# EAGLE design scooter (EAGLE 4.16)
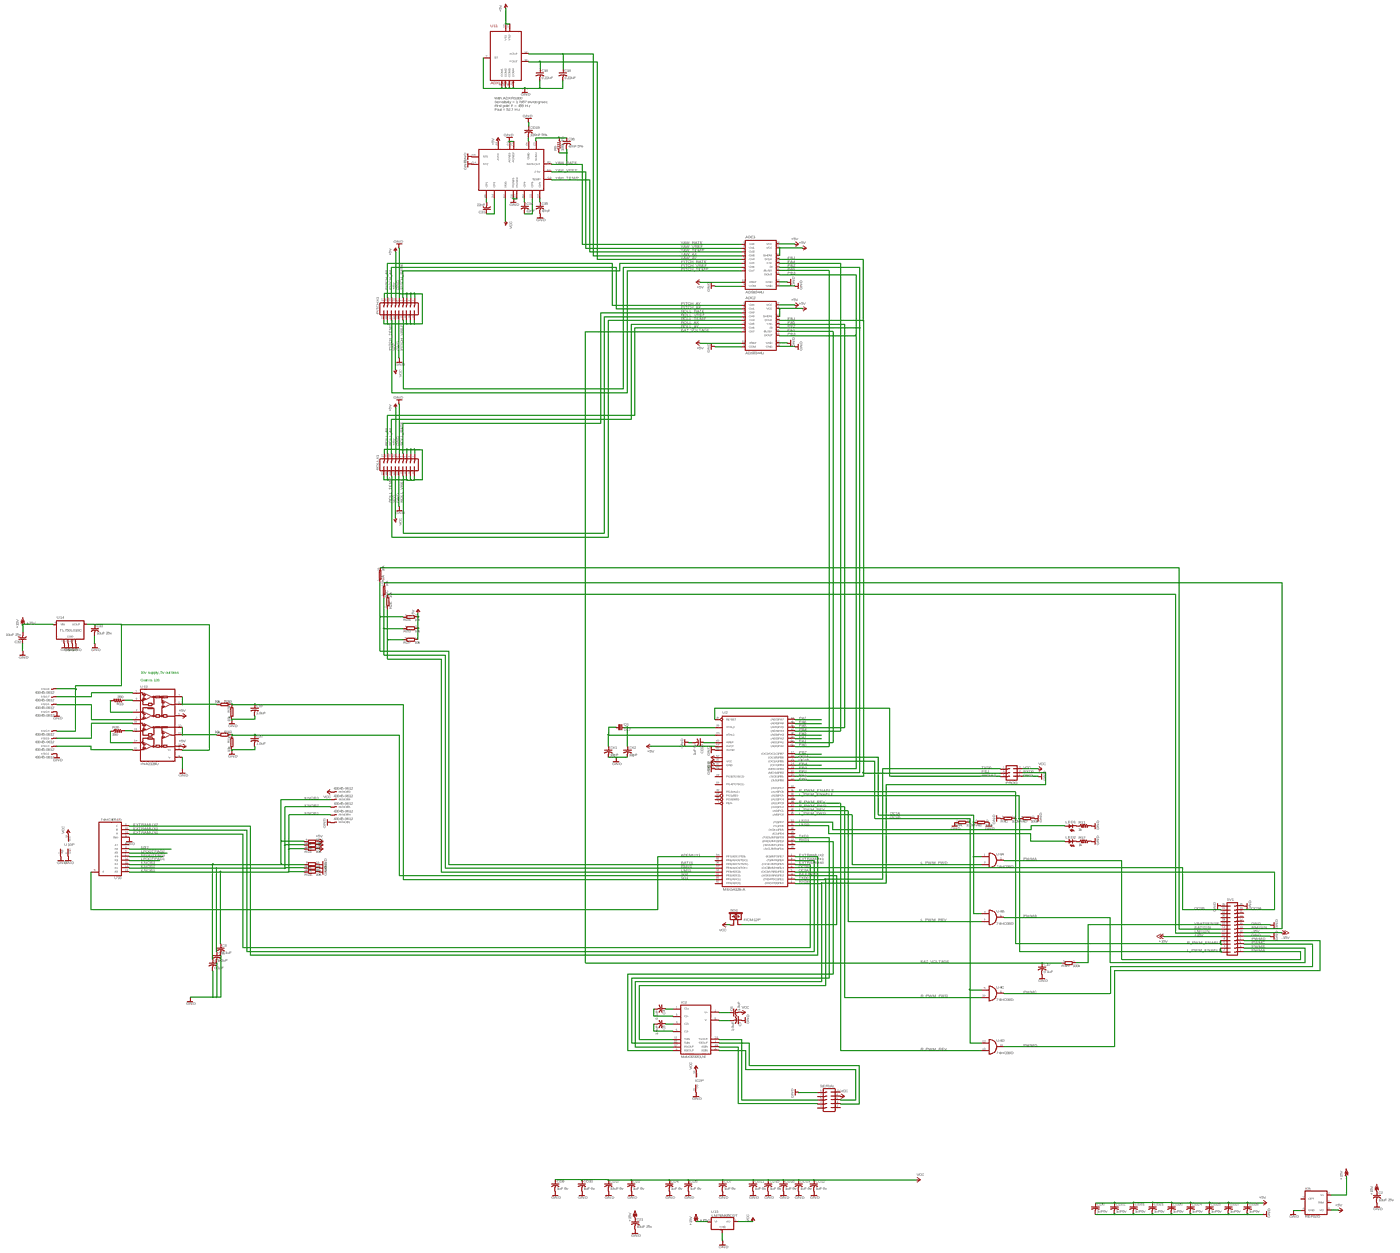
[diagram p0: schematic, sheet 1, overview]
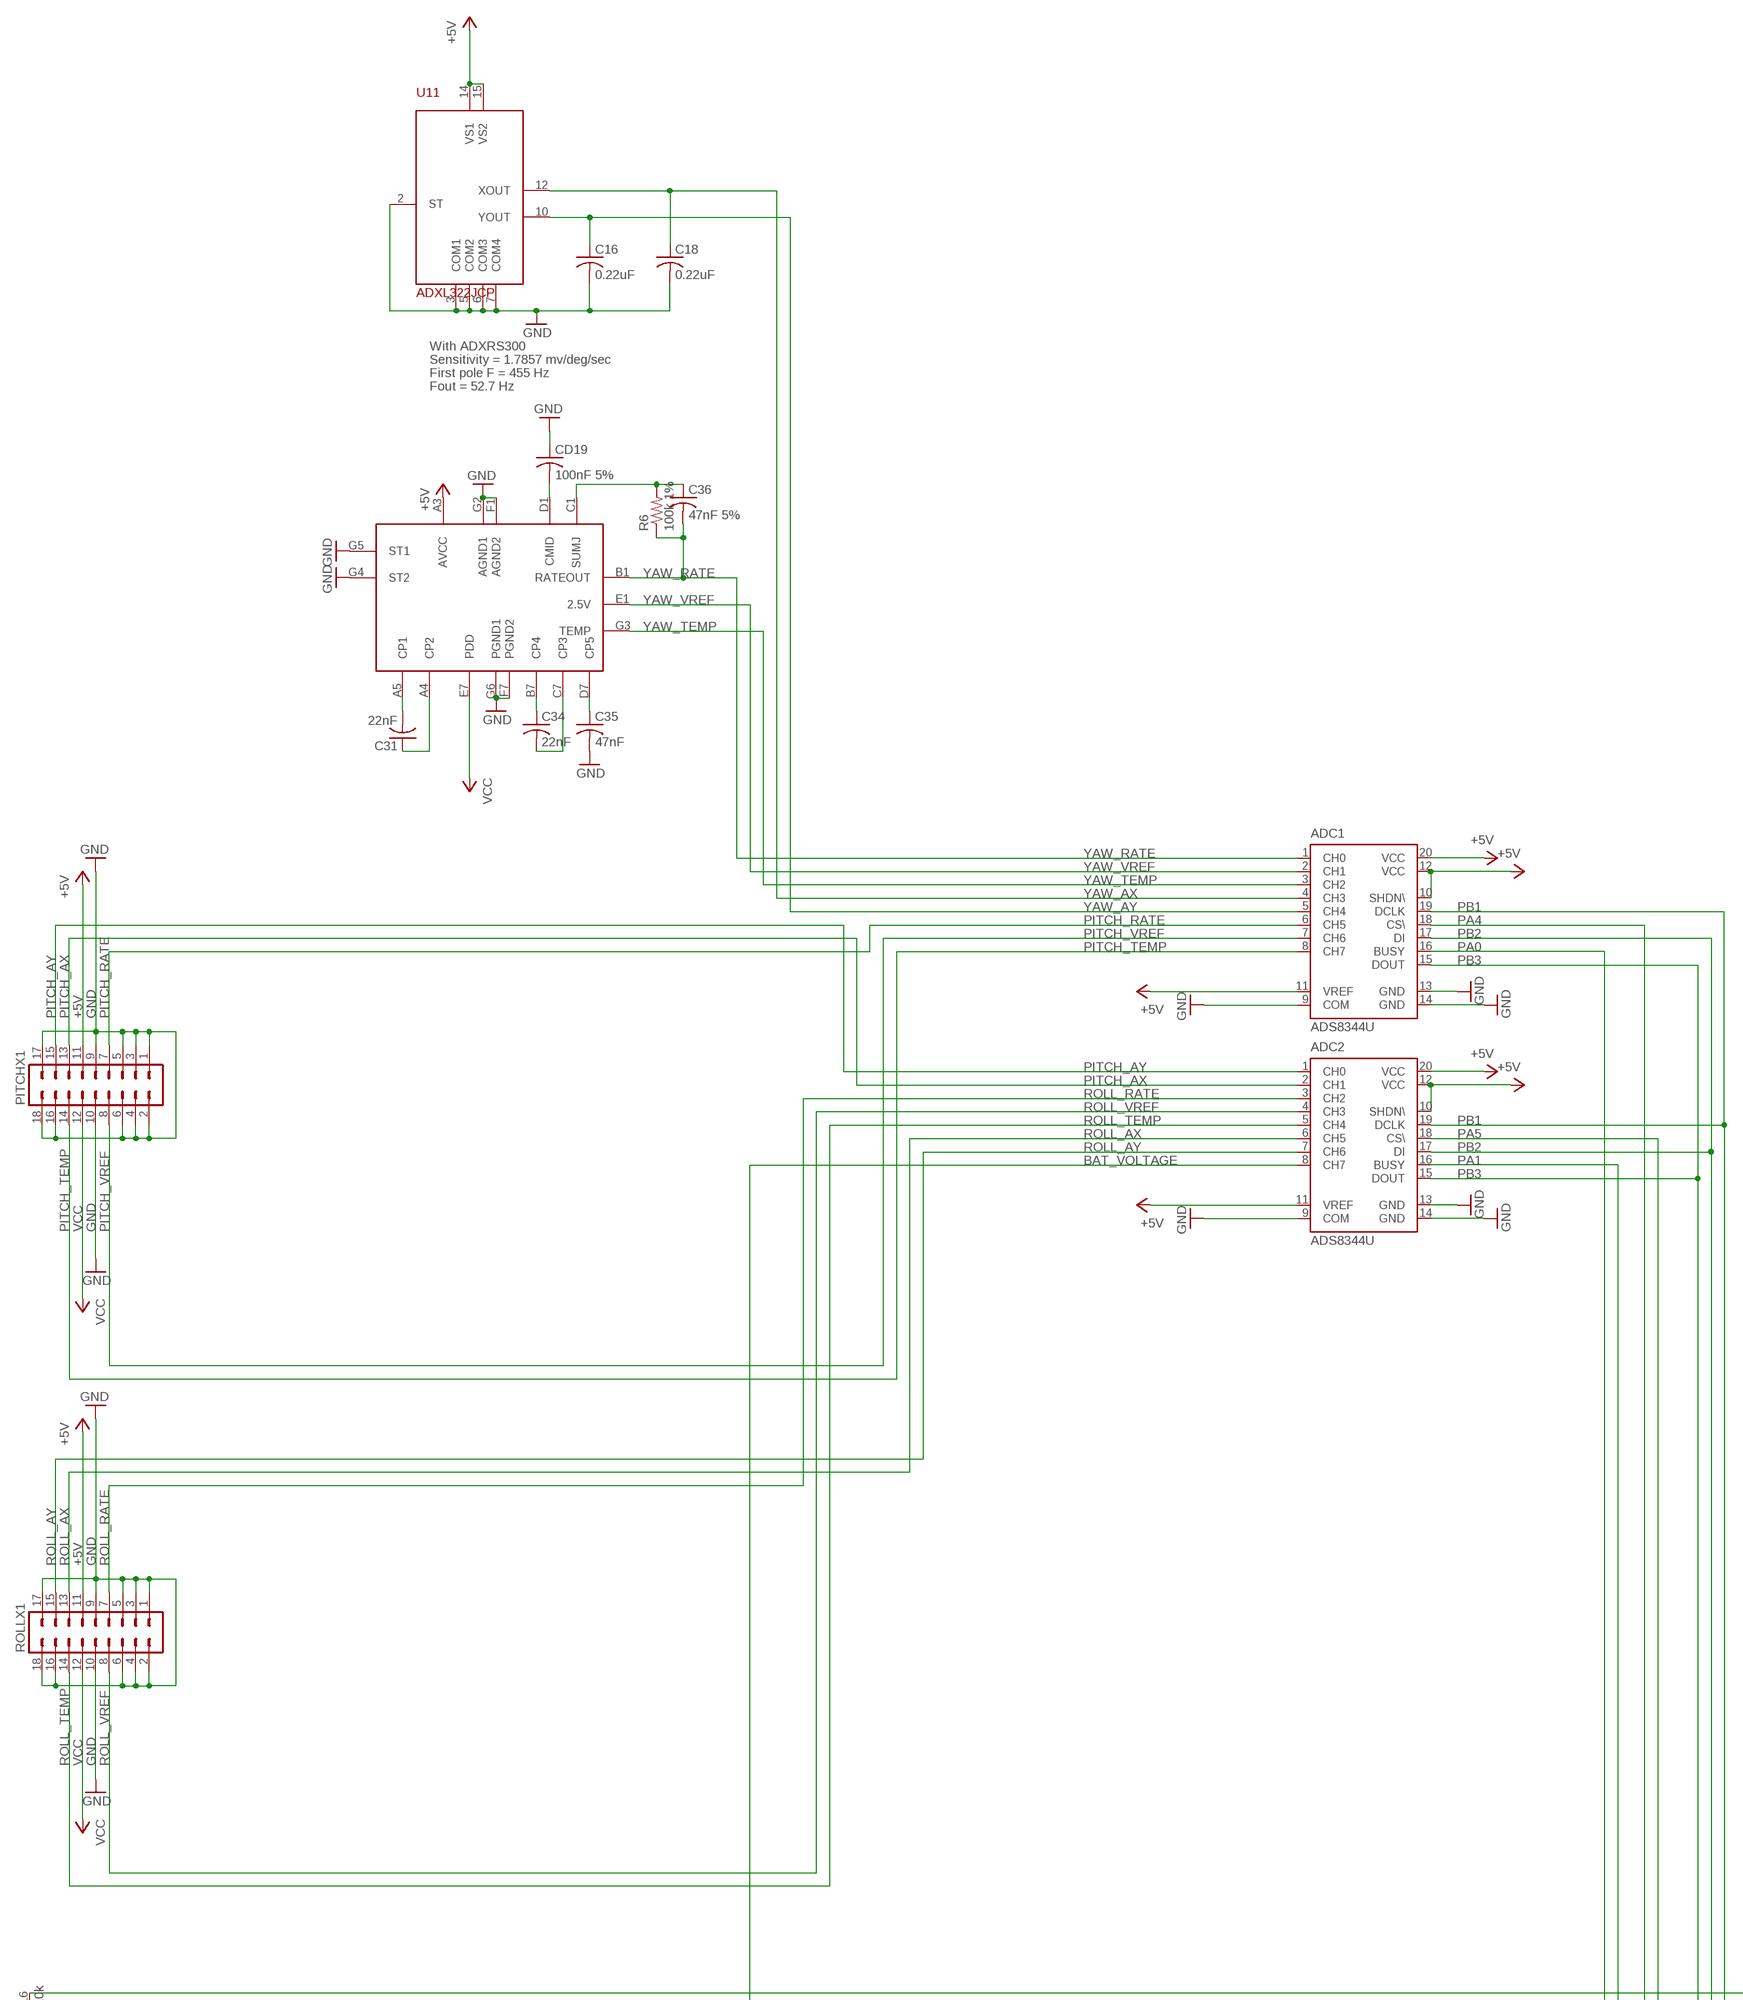
[diagram p1: schematic, sheet 1, part 1 of 4]
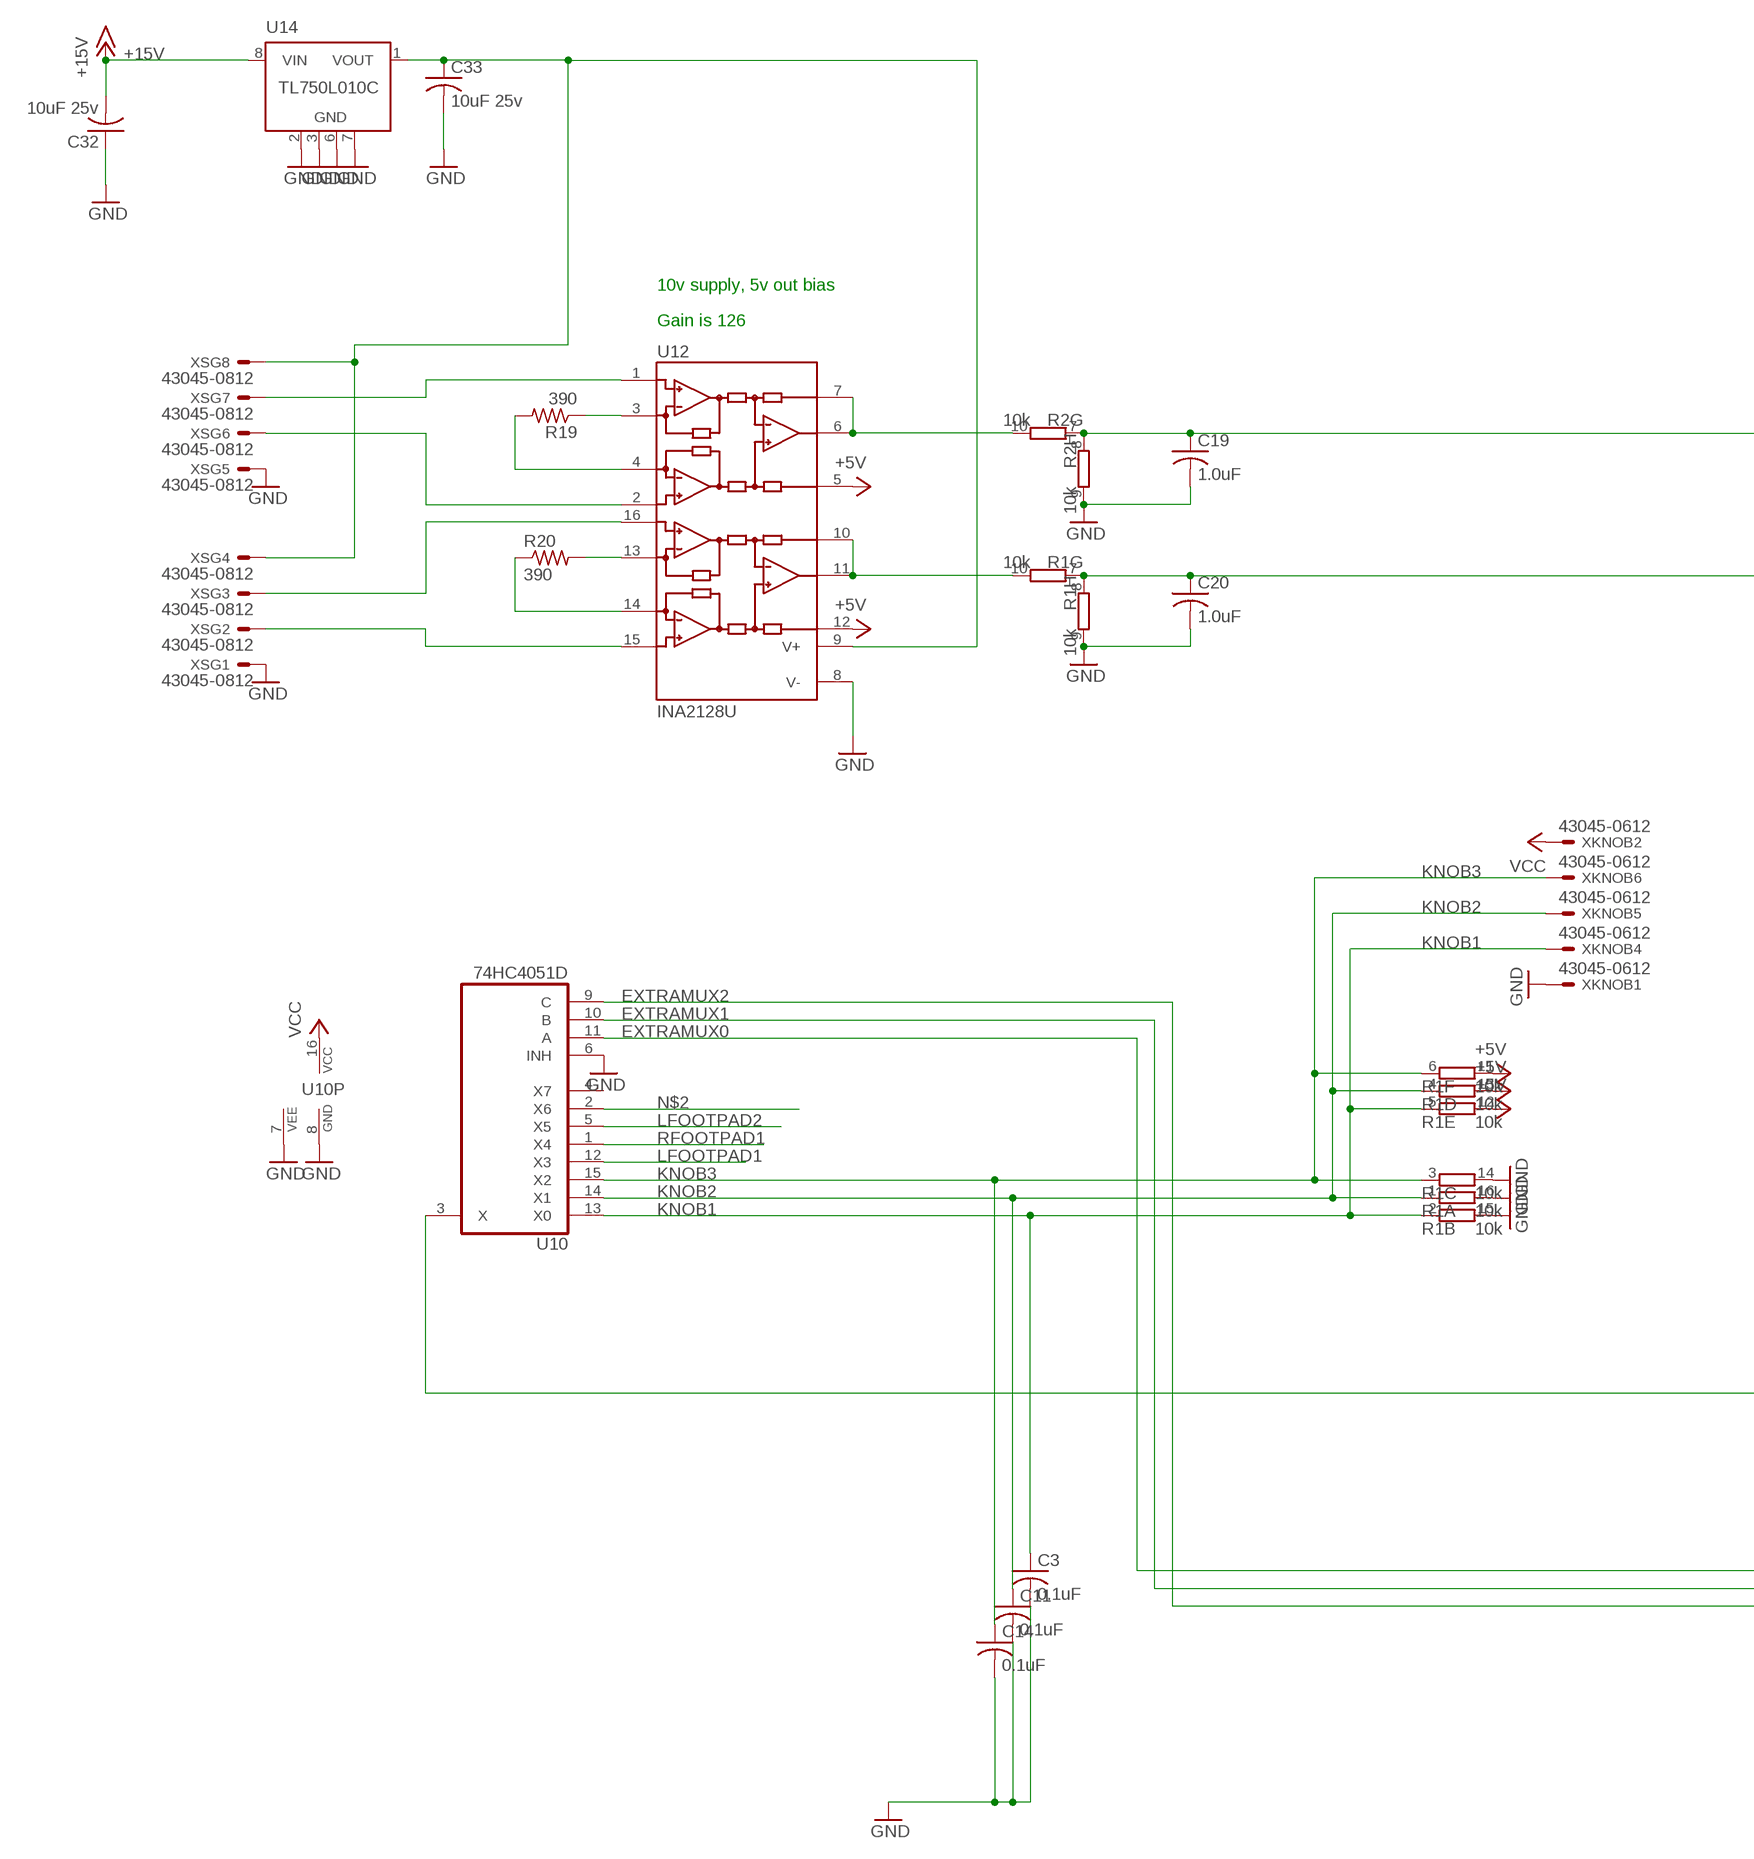
[diagram p2: schematic, sheet 1, part 2 of 4]
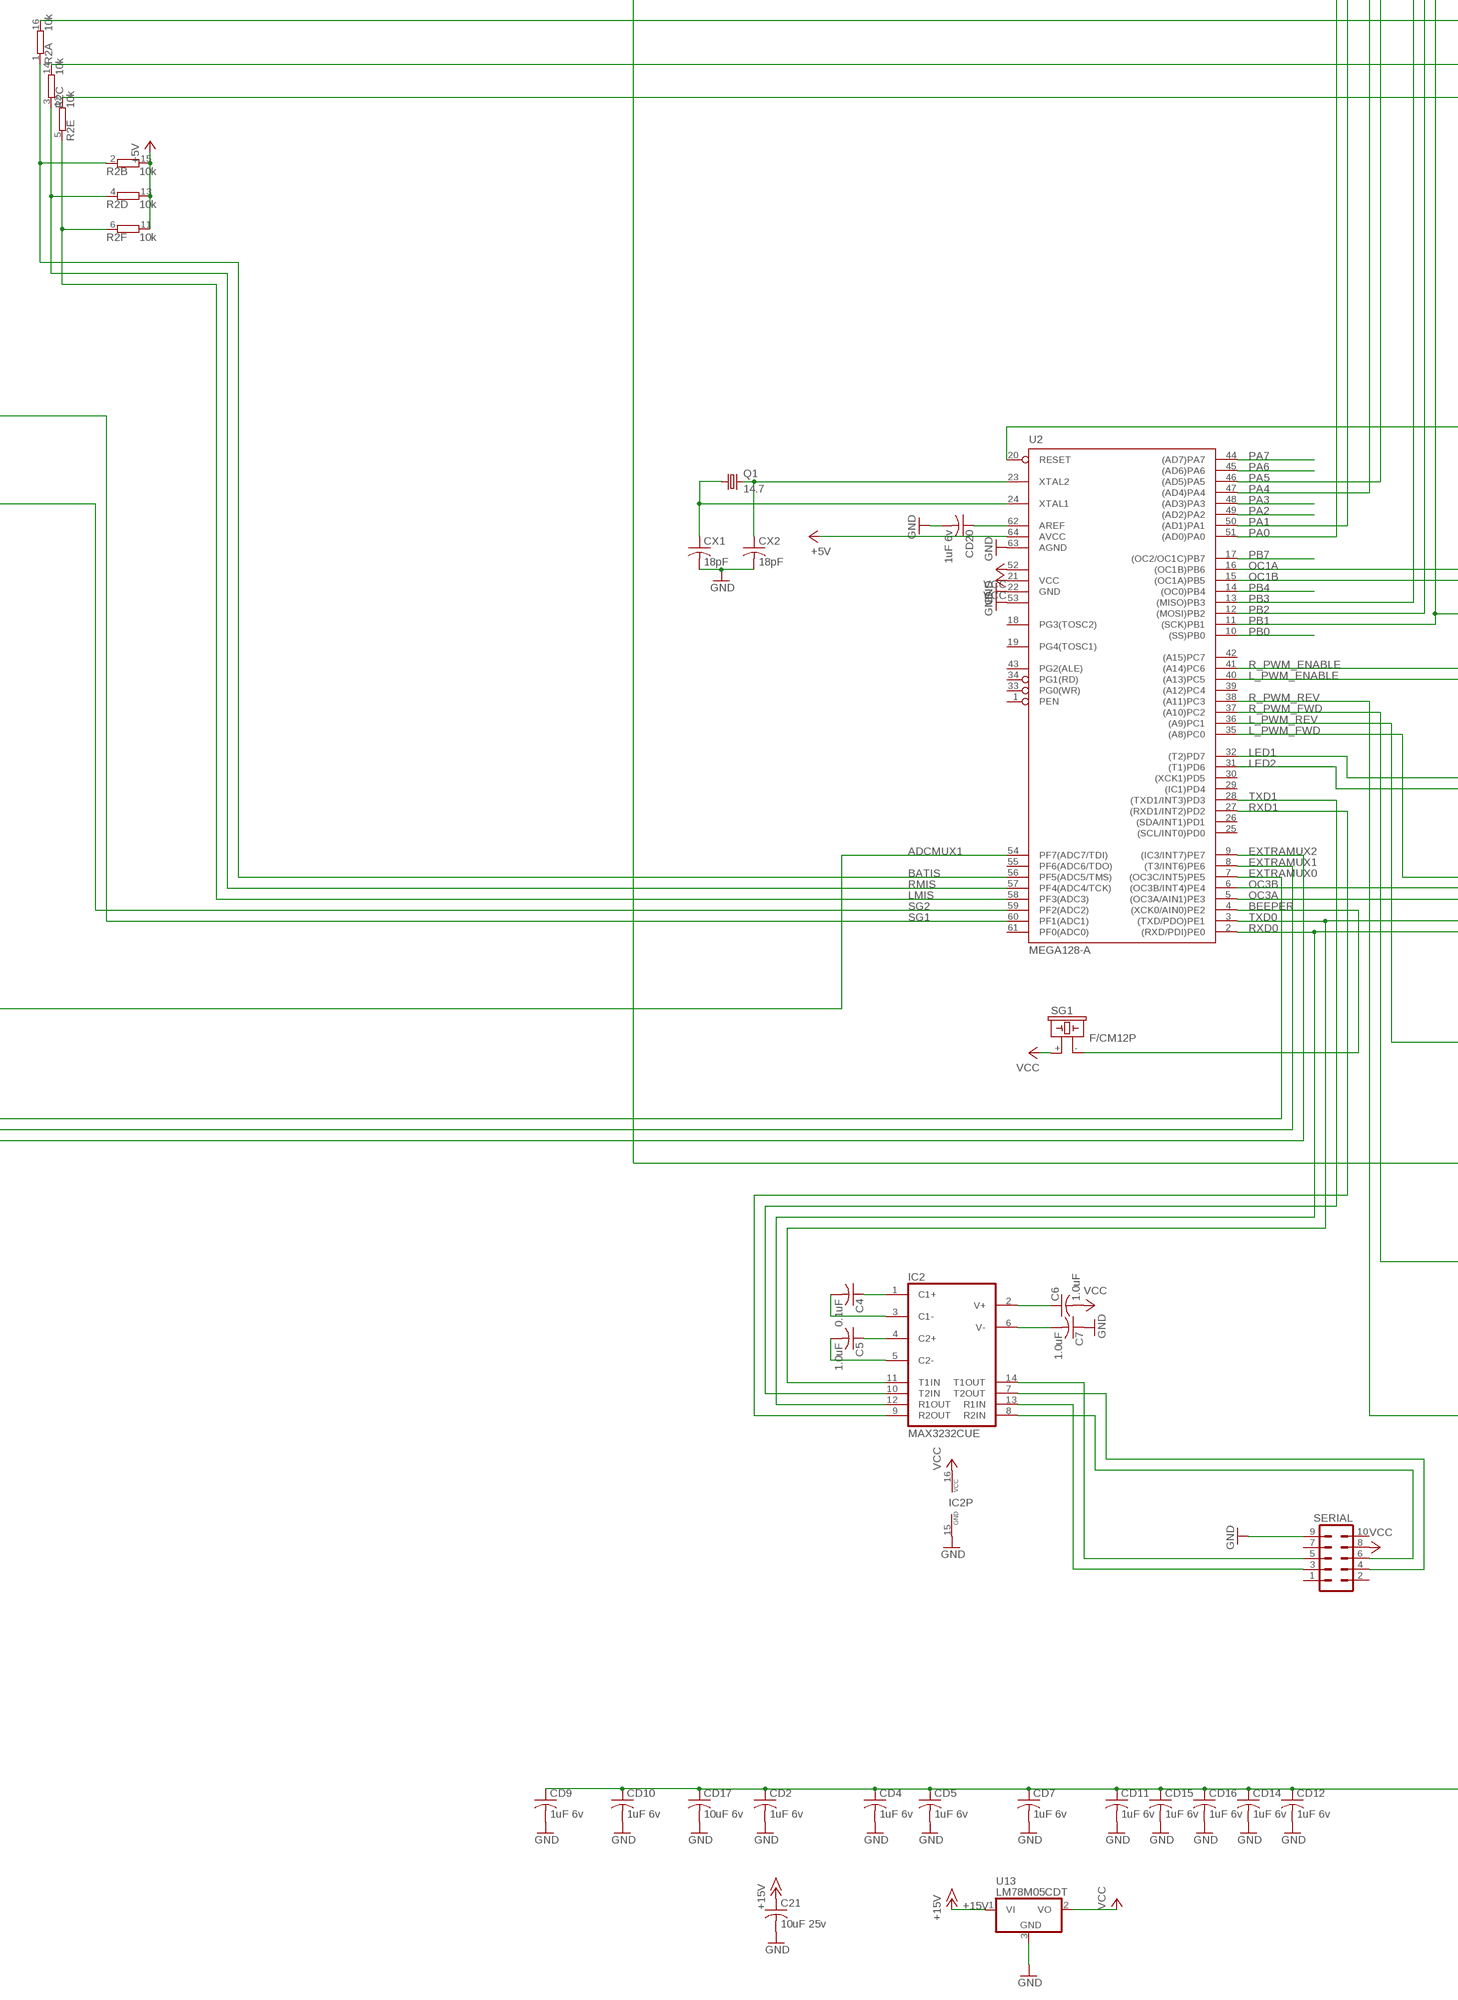
[diagram p3: schematic, sheet 1, part 3 of 4]
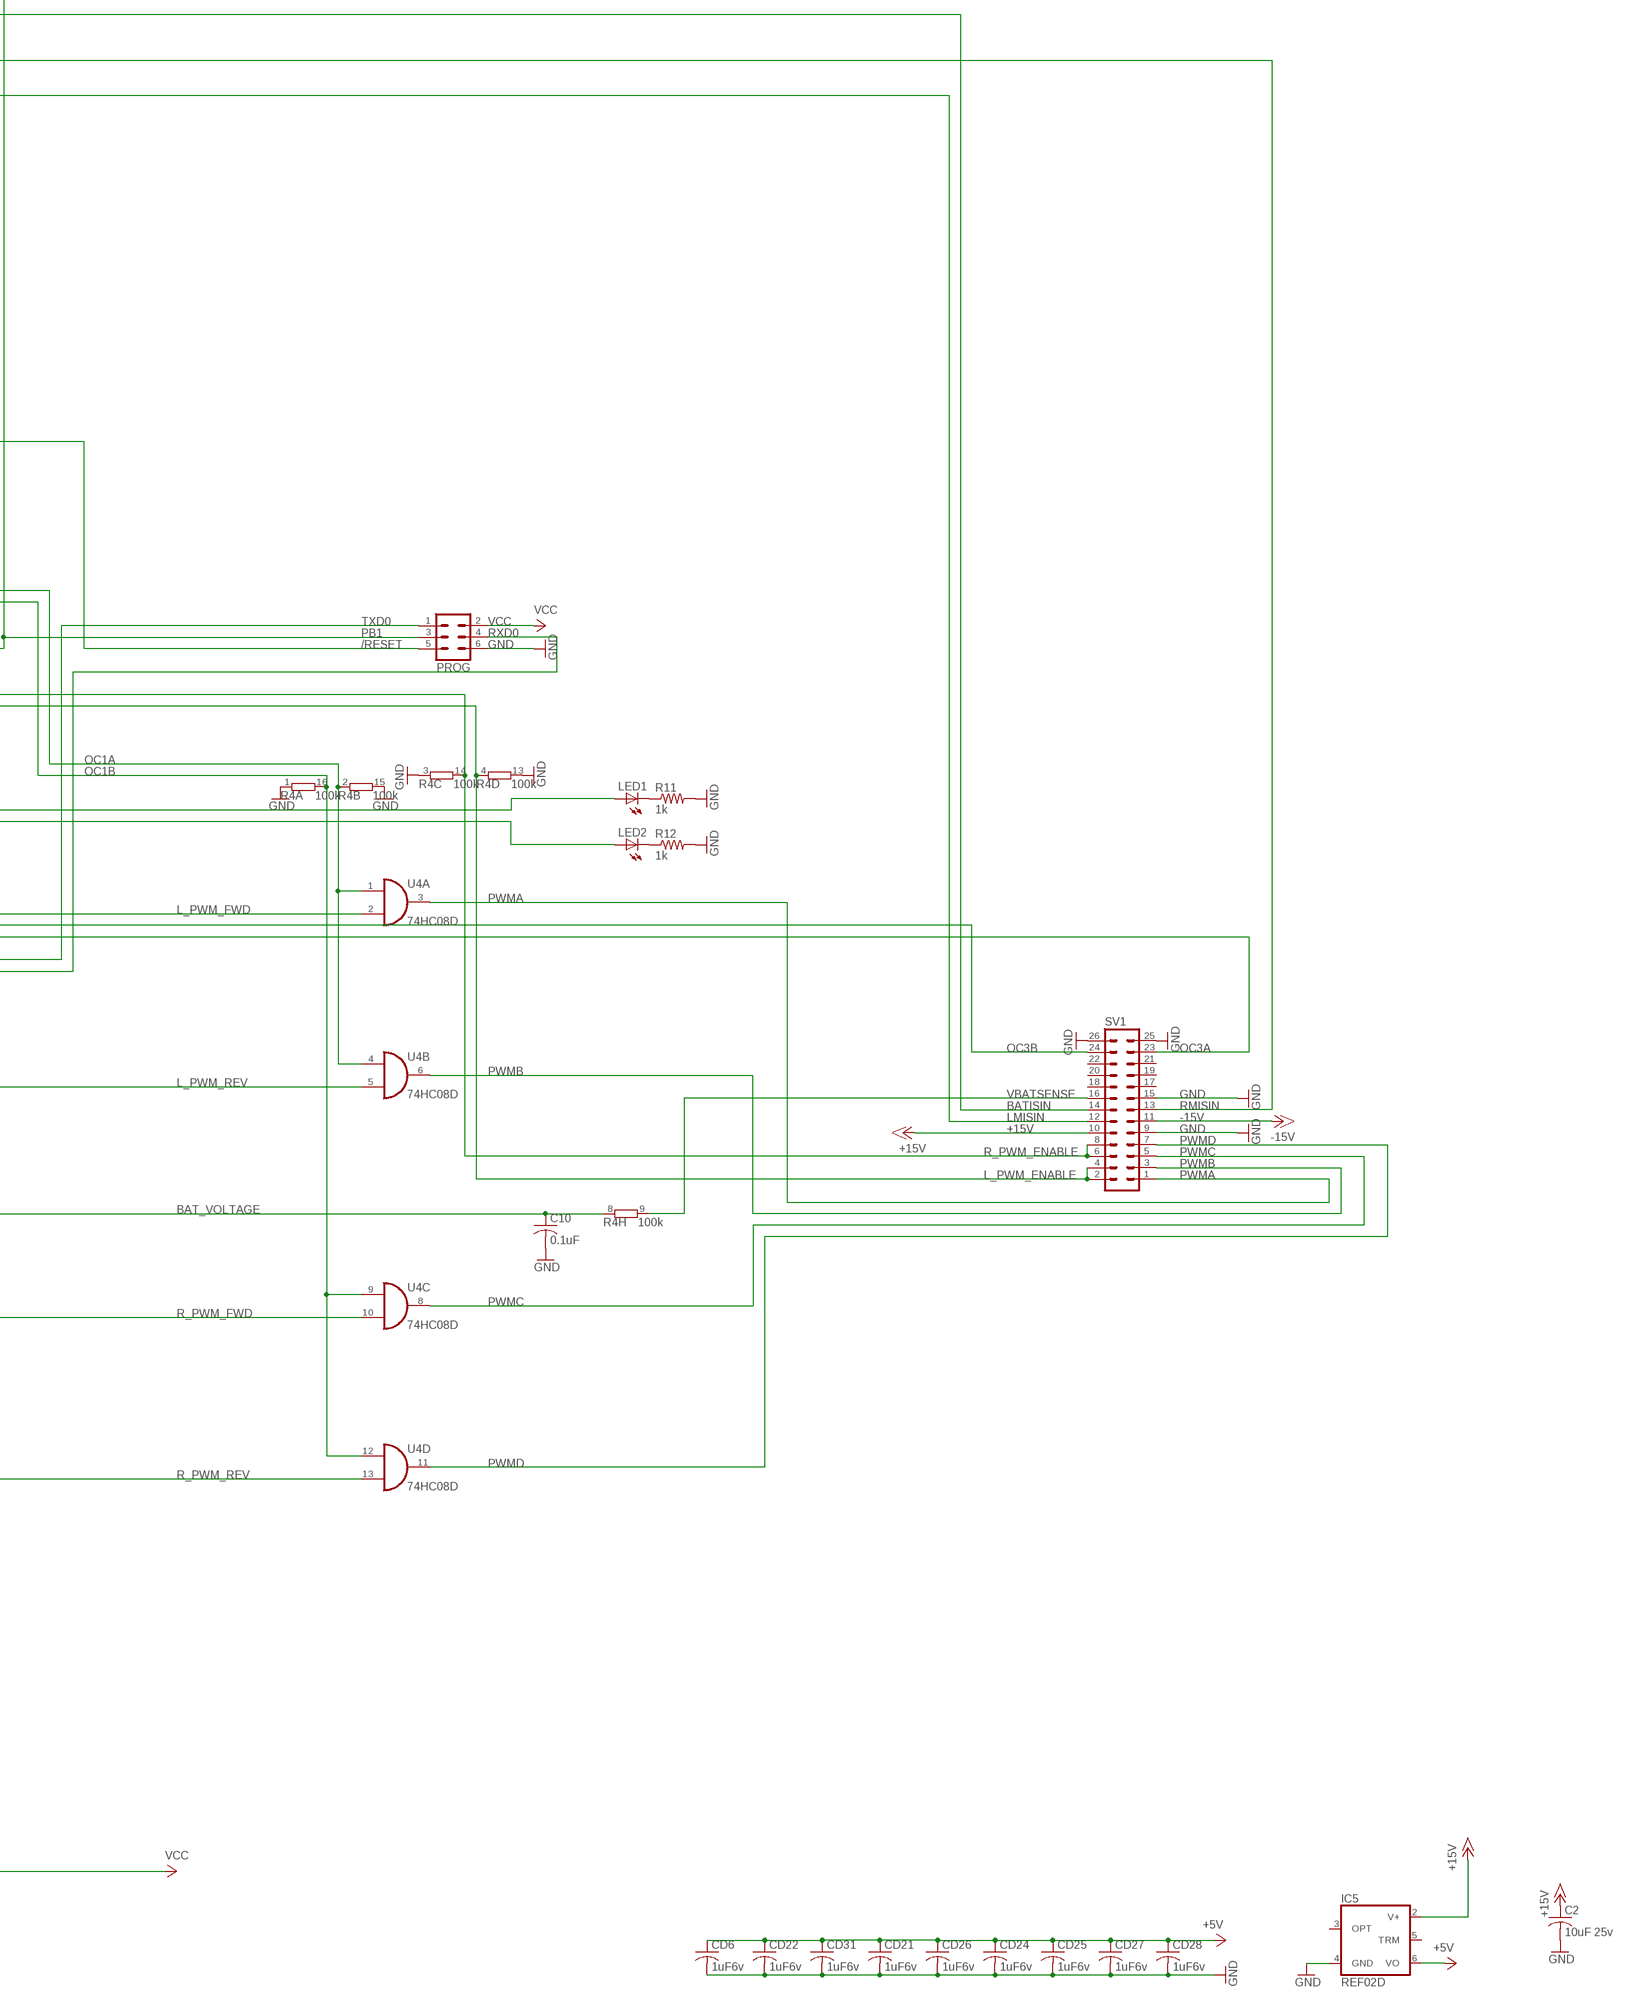
[diagram p4: schematic, sheet 1, part 4 of 4]

## Parts
ADC1  ADS8344U  [SSOP20BU]
ADC2  ADS8344U  [SSOP20BU]
C2  10uF 25v  C-USC1206  [C1206]
C3  0.1uF  C-USC0805  [C0805]
C4  0.1uF  C-USC0805  [C0805]
C5  1.0uF  C-USC0805  [C0805]
C6  1.0uF  C-USC0805  [C0805]
C7  1.0uF  C-USC0805  [C0805]
C10  0.1uF  C-USC0805  [C0805]
C11  0.1uF  C-USC0805  [C0805]
C14  0.1uF  C-USC0805  [C0805]
C16  0.22uF  C-USC0402  [C0402]
C18  0.22uF  C-USC0402  [C0402]
C19  1.0uF  C-USC0805  [C0805]
C20  1.0uF  C-USC0805  [C0805]
C21  10uF 25v  C-USC1206  [C1206]
C31  22nF  C-USC0402  [C0402]
C32  10uF 25v  C-USC1206  [C1206]
C33  10uF 25v  C-USC1206  [C1206]
C34  22nF  C-USC0402  [C0402]
C35  47nF  C-USC0402  [C0402]
C36  47nF 5%  C-USC0402  [C0402]
CD2  1uF 6v  C-USC0402  [C0402]
CD4  1uF 6v  C-USC0402  [C0402]
CD5  1uF 6v  C-USC0402  [C0402]
CD6  1uF6v  C-USC0402  [C0402]
CD7  1uF 6v  C-USC0402  [C0402]
CD9  1uF 6v  C-USC0402  [C0402]
CD10  1uF 6v  C-USC0402  [C0402]
CD11  1uF 6v  C-USC0402  [C0402]
CD12  1uF 6v  C-USC0402  [C0402]
CD14  1uF 6v  C-USC0402  [C0402]
CD15  1uF 6v  C-USC0402  [C0402]
CD16  1uF 6v  C-USC0402  [C0402]
CD17  10uF 6v  C-USC0805  [C0805]
CD19  100nF 5%  C-USC0402  [C0402]
CD20  1uF 6v  C-USC0402  [C0402]
CD21  1uF6v  C-USC0402  [C0402]
CD22  1uF6v  C-USC0402  [C0402]
CD24  1uF6v  C-USC0402  [C0402]
CD25  1uF6v  C-USC0402  [C0402]
CD26  1uF6v  C-USC0402  [C0402]
CD27  1uF6v  C-USC0402  [C0402]
CD28  1uF6v  C-USC0402  [C0402]
CD31  1uF6v  C-USC0402  [C0402]
CX1  18pF  C-USC0402  [C0402]
CX2  18pF  C-USC0402  [C0402]
IC2  MAX3232CUE  [TSSOP16]
IC5  REF02D  [SO08]
LED1  LEDCHIP-LED0805  [CHIP-LED0805]
LED2  LEDCHIP-LED0805  [CHIP-LED0805]
PITCHX1  MA09-2  [MA09-2]
PROG  MA03-2  [MA03-2]
Q1  14.7  CRYTALHC49S  [HC49/S]
R1  10k  4816P-T01E  [4816P]
R2  10k  4816P-T01E  [4816P]
R4  100k  4816P-T01E  [4816P]
R6  100k 1%  R-US_R0402  [R0402]
R11  1k  R-US_R0805  [R0805]
R12  1k  R-US_R0805  [R0805]
R19  390  R-US_R0805  [R0805]
R20  390  R-US_R0805  [R0805]
ROLLX1  MA09-2  [MA09-2]
SERIAL  MA05-2  [MA05-2]
SG1  F/CM12P  [F/CM12P]
SV1  MA13-2  [MA13-2]
U2  MEGA128-A  [TQFP64]
U4  74HC08D  [SO14]
U10  74HC4051D  4051D  [SO16]
U11  ADXL322JCP  [LFCSP16]
U12  INA2128U  [SO16-1]
U13  LM78M05CDT  7805DT  [TO252]
U14  TL750L010C  78L08SMD  [SO08]
UYAW  ADXRS300ABG  ADXRS150ABG  [BC-32]
XKNOB  43045-0612  [43045-0612]
XSG  43045-0812  [43045-0812]

## Nets
+5V [pwr]: ADC1.10(SHDN\) ADC1.11(VREF) ADC1.12(VCC) ADC1.20(VCC) ADC2.10(SHDN\) ADC2.11(VREF) ADC2.12(VCC) ADC2.20(VCC) CD6.1 CD21.1 CD22.1 CD24.1 CD25.1 CD26.1 CD27.1 CD28.1 CD31.1 IC5.6(VO) PITCHX1.11 R1.11 R1.12 R1.13 R2.11 R2.13 R2.15 ROLLX1.11 U2.64(AVCC) U11.14(VS1) U11.15(VS2) U12.5(REFA) U12.12(REFB) UYAW.A3(AVCC)
+15V [pwr]: C2.1 C21.1 C32.2 IC5.2(V+) SV1.10 U13.1(VI) U14.8(VIN)
-15V [pwr]: SV1.11
/RESET: PROG.5 U2.20(RESET)
ADCMUX1: U2.54(PF7(ADC7/TDI)) U10.3(X)
AREF: CD20.1 U2.62(AREF)
BAT_VOLTAGE: ADC2.8(CH7) C10.1 R4.8
BATIS: R2.1 R2.2 U2.56(PF5(ADC5/TMS))
BATISIN: R2.16 SV1.14
BEEPER: SG1.- U2.4((XCK0/AIN0)PE2)
EXTRAMUX0: U2.7((OC3C/INT5)PE5) U10.11(A)
EXTRAMUX1: U2.8((T3/INT6)PE6) U10.10(B)
EXTRAMUX2: U2.9((IC3/INT7)PE7) U10.9(C)
GND [pwr]: ADC1.9(COM) ADC1.13(GND) ADC1.14(GND) ADC2.9(COM) ADC2.13(GND) ADC2.14(GND) C2.2 C3.2 C7.1 C10.2 C11.2 C14.2 C16.2 C18.2 C19.2 C20.2 C21.2 C32.1 C33.2 C35.2 CD2.2 CD4.2 CD5.2 CD6.2 CD7.2 CD9.2 CD10.2 CD11.2 CD12.2 CD14.2 CD15.2 CD16.2 CD17.2 CD19.1 CD20.2 CD21.2 CD22.2 CD24.2 CD25.2 CD26.2 CD27.2 CD28.2 CD31.2 CX1.2 CX2.2 IC2.15(GND) IC5.4(GND) PITCHX1.1 PITCHX1.2 PITCHX1.3 PITCHX1.4 PITCHX1.5 PITCHX1.6 PITCHX1.9 PITCHX1.10 PITCHX1.16 PITCHX1.17 PITCHX1.18 PROG.6 R1.9 R1.14 R1.15 R1.16 R2.9 R4.1 R4.3 R4.13 R4.15 R11.2 R12.2 ROLLX1.1 ROLLX1.2 ROLLX1.3 ROLLX1.4 ROLLX1.5 ROLLX1.6 ROLLX1.9 ROLLX1.10 ROLLX1.16 ROLLX1.17 ROLLX1.18 SERIAL.9 SV1.9 SV1.15 SV1.25 SV1.26 U2.22(GND) U2.53(GND1) U2.63(AGND) U10.6(INH) U10.7(VEE) U10.8(GND) U11.2(ST) U11.3(COM1) U11.5(COM2) U11.6(COM3) U11.7(COM4) U12.8(V-) U13.3(GND) U14.2(GND) U14.3(GND) U14.6(GND) U14.7(GND) UYAW.F1(AGND2) UYAW.F7(PGND2) UYAW.G2(AGND1) UYAW.G4(ST2) UYAW.G5(ST1) UYAW.G6(PGND1) XKNOB.1 XSG.1 XSG.5
KNOB1: C3.1 R1.2 R1.5 U10.13(X0) XKNOB.4
KNOB2: C11.1 R1.1 R1.4 U10.14(X1) XKNOB.5
KNOB3: C14.1 R1.3 R1.6 U10.15(X2) XKNOB.6
L_PWM_ENABLE: R4.4 SV1.2 SV1.4 U2.40((A13)PC5)
L_PWM_FWD: U2.35((A8)PC0) U4.2(A:I1)
L_PWM_REV: U2.36((A9)PC1) U4.5(B:I1)
LED1: LED1.A U2.32((T2)PD7)
LED2: LED2.A U2.31((T1)PD6)
LFOOTPAD1: U10.12(X3)
LFOOTPAD2: U10.5(X5)
LMIS: R2.5 R2.6 U2.58(PF3(ADC3))
LMISIN: R2.12 SV1.12
MCUXTAL1: CX1.1 Q1.1 U2.24(XTAL1)
MCUXTAL2: CX2.1 Q1.2 U2.23(XTAL2)
N$1: R19.1 U12.3(RGA)
N$2: U10.2(X6)
N$3: CD19.2 UYAW.D1(CMID)
N$8: R2.10 U12.6(VOA) U12.7(SENSEA)
N$9: R1.10 U12.10(SENSEB) U12.11(VOB)
N$10: R19.2 U12.4(RGA)
N$11: C4.1 IC2.1(C1+)
N$12: C5.1 IC2.4(C2+)
N$13: R20.2 U12.13(RGB)
N$14: LED1.C R11.1
N$15: R20.1 U12.14(RGB)
N$16: LED2.C R12.1
N$17: U12.1(INA-) XSG.7
N$18: U12.2(INA+) XSG.6
N$19: U12.16(INB-) XSG.3
N$20: C5.2 IC2.5(C2-)
N$21: U12.15(INB+) XSG.2
N$22: C4.2 IC2.3(C1-)
N$24: C6.1 IC2.2(V+)
N$26: C7.2 IC2.6(V-)
N$33: IC2.14(T1OUT) SERIAL.5
N$34: IC2.13(R1IN) SERIAL.3
N$35: IC2.7(T2OUT) SERIAL.4
N$36: IC2.8(R2IN) SERIAL.6
N$41: C34.1 UYAW.B7(CP4)
N$42: C35.1 UYAW.D7(CP5)
N$43: C36.1 R6.2 UYAW.C1(SUMJ)
N$44: C34.2 UYAW.C7(CP3)
N$45: C31.1 UYAW.A4(CP2)
N$46: C31.2 UYAW.A5(CP1)
OC1A: R4.2 U2.16((OC1B)PB6) U4.1(A:I0) U4.4(B:I0)
OC1B: R4.16 U2.15((OC1A)PB5) U4.9(C:I0) U4.12(D:I0)
OC3A: SV1.23 U2.5((OC3A/AIN1)PE3)
OC3B: SV1.24 U2.6((OC3B/INT4)PE4)
PA0: ADC1.16(BUSY) U2.51((AD0)PA0)
PA1: ADC2.16(BUSY) U2.50((AD1)PA1)
PA2: U2.49((AD2)PA2)
PA3: U2.48((AD3)PA3)
PA4: ADC1.18(CS\) U2.47((AD4)PA4)
PA5: ADC2.18(CS\) U2.46((AD5)PA5)
PA6: U2.45((AD6)PA6)
PA7: U2.44((AD7)PA7)
PB0: U2.10((SS)PB0)
PB1: ADC1.19(DCLK) ADC2.19(DCLK) PROG.3 U2.11((SCK)PB1)
PB2: ADC1.17(DI) ADC2.17(DI) U2.12((MOSI)PB2)
PB3: ADC1.15(DOUT) ADC2.15(DOUT) U2.13((MISO)PB3)
PB4: U2.14((OC0)PB4)
PB7: U2.17((OC2/OC1C)PB7)
PITCH_AX: ADC2.2(CH1) PITCHX1.13
PITCH_AY: ADC2.1(CH0) PITCHX1.15
PITCH_RATE: ADC1.6(CH5) PITCHX1.7
PITCH_TEMP: ADC1.8(CH7) PITCHX1.14
PITCH_VREF: ADC1.7(CH6) PITCHX1.8
PWMA: SV1.1 U4.3(A:O)
PWMB: SV1.3 U4.6(B:O)
PWMC: SV1.5 U4.8(C:O)
PWMD: SV1.7 U4.11(D:O)
R_PWM_ENABLE: R4.14 SV1.6 SV1.8 U2.41((A14)PC6)
R_PWM_FWD: U2.37((A10)PC2) U4.10(C:I1)
R_PWM_REV: U2.38((A11)PC3) U4.13(D:I1)
RFOOTPAD1: U10.1(X4)
RMIS: R2.3 R2.4 U2.57(PF4(ADC4/TCK))
RMISIN: R2.14 SV1.13
ROLL_AX: ADC2.6(CH5) ROLLX1.13
ROLL_AY: ADC2.7(CH6) ROLLX1.15
ROLL_RATE: ADC2.3(CH2) ROLLX1.7
ROLL_TEMP: ADC2.5(CH4) ROLLX1.14
ROLL_VREF: ADC2.4(CH3) ROLLX1.8
RXD0: IC2.12(R1OUT) PROG.4 U2.2((RXD/PDI)PE0)
RXD1: IC2.9(R2OUT) U2.27((RXD1/INT2)PD2)
SG1: C19.1 R2.7 R2.8 U2.60(PF1(ADC1))
SG2: C20.1 R1.7 R1.8 U2.59(PF2(ADC2))
SGPWR: C33.1 U12.9(V+) U14.1(VOUT) XSG.4 XSG.8
TXD0: IC2.11(T1IN) PROG.1 U2.3((TXD/PDO)PE1)
TXD1: IC2.10(T2IN) U2.28((TXD1/INT3)PD3)
VBATSENSE: R4.9 SV1.16
VCC [pwr]: C6.2 CD2.1 CD4.1 CD5.1 CD7.1 CD9.1 CD10.1 CD11.1 CD12.1 CD14.1 CD15.1 CD16.1 CD17.1 IC2.16(VCC) PITCHX1.12 PROG.2 ROLLX1.12 SERIAL.8 SG1.+ U2.21(VCC) U2.52(VCC1) U10.16(VCC) U13.2(VO) UYAW.E7(PDD) XKNOB.2
YAW_AX: ADC1.4(CH3) C18.1 U11.12(XOUT)
YAW_AY: ADC1.5(CH4) C16.1 U11.10(YOUT)
YAW_RATE: ADC1.1(CH0) C36.2 R6.1 UYAW.B1(RATEOUT)
YAW_TEMP: ADC1.3(CH2) UYAW.G3(TEMP)
YAW_VREF: ADC1.2(CH1) UYAW.E1(2.5V)
Unconnected: IC5.3(OPT) IC5.5(TRM) R4.5 R4.6 R4.7 R4.10 R4.11 R4.12 SERIAL.1 SERIAL.2 SERIAL.7 SERIAL.10 SV1.17 SV1.18 SV1.19 SV1.20 SV1.21 SV1.22 U2.1(PEN) U2.18(PG3(TOSC2)) U2.19(PG4(TOSC1)) U2.25((SCL/INT0)PD0) U2.26((SDA/INT1)PD1) U2.29((IC1)PD4) U2.30((XCK1)PD5) U2.33(PG0(WR)) U2.34(PG1(RD)) U2.39((A12)PC4) U2.42((A15)PC7) U2.43(PG2(ALE)) U2.55(PF6(ADC6/TDO)) U2.61(PF0(ADC0)) U10.4(X7) U14.4(NC) U14.5(NC) XKNOB.3

## Notes on the sheet
- With ADXRS300
- Sensitivity = 1.7857 mv/deg/sec
- First pole F = 455 Hz
- Fout = 52.7 Hz
- 10v supply, 5v out bias
- Gain is 126

## Power pins joined to a net without a drawn wire
GND: U4.7(P:GND)
VCC: U4.14(P:VCC)

## Library data of the parts
ADC1 ADC2 = burr-brown:ADS8344: 16-Bit, 8-Channel Serial Output Sampling ADC
C2-C7 C10 C11 C14 C16 C18-C21 C31-C36 CD2 CD4-CD7 CD9-CD12 CD14-CD17 CD19-CD22 CD24-CD28 CD31 CX1 CX2 = rcl:C-US: CAPACITOR, American symbol
IC2 = maxim:MAX3232*: True RS-232 Transceivers 3.0V to 5.5V, Low-Power up to 1Mbps, Using Four 0.1µF External Capacitors Source: http://pdfserv.maxim-ic.com/en/ds/MAX3222-MAX3241.pdf
IC5 = linear:REF02: VOLTAGE REFERENCE
LED1 LED2 = led:LED: LED OSRAM: - CHIPLED LG R971, LG N971, LY N971, LG Q971, LY Q971, LO R971, LY R971 LH N974, LH R974 LS Q976, LO Q976, LY Q976 LO Q996 - Hyper CHIPLED LW Q18S LB Q993, LB Q99A, LB R99A - SideLED LS A670, LO A670, LY A670, LG A670, LP A670 LB A673, LV A673, LT A673, LW A673 LH A674 LY A675 LS A676, LA A676, LO A676, LY A676, LW A676 LS A679, LY A679, LG A679 - Hyper Micro SIDELED® LS Y876, LA Y876, LO Y876, LY Y876 LT Y87S - SmartLED LW L88C, LW L88S LB L89C, LB L89S, LG L890 LS L89K, LO L89K, LY L89K LS L896, LA L896, LO L896, LY L896 - TOPLED LS T670, LO T670, LY T670, LG T670, LP T670 LSG T670, LSP T670, LSY T670, LOP T670, LYG T670 LG T671, LOG T671, LSG T671 LB T673, LV T673, LT T673, LW T673 LH T674 LS T676, LA T676, LO T676, LY T676, LB T676, LH T676, LSB T676, LW T676 LB T67C, LV T67C, LT T67C, LS T67K, LO T67K, LY T67K, LW E67C LS E67B, LA E67B, LO E67B, LY E67B, LB E67C, LV E67C, LT E67C LW T67C LS T679, LY T679, LG T679 LS T770, LO T770, LY T770, LG T770, LP T770 LB T773, LV T773, LT T773, LW T773 LH T774 LS E675, LA E675, LY E675, LS T675 LS T776, LA T776, LO T776, LY T776, LB T776 LHGB T686 LT T68C, LB T68C - Hyper Mini TOPLED® LB M676 - Mini TOPLED Santana® LG M470 LS M47K, LO M47K, LY M47K Source: http://www.osram.convergy.de/
PITCHX1 ROLLX1 = con-lstb:MA09-2: PIN HEADER
PROG = con-lstb:MA03-2: PIN HEADER
Q1 = crystal:CRYTAL: CRYSTAL
R1 R2 R4 = resistor-bourns:4816P-T01E: BOURNS RESISTOR NETWORK
R6 R11 R12 R19 R20 = rcl:R-US_: RESISTOR, American symbol
SERIAL = con-lstb:MA05-2: PIN HEADER
SG1 = buzzer:F/CM12P: BUZZER Source: Buerklin
SV1 = con-lstb:MA13-2: PIN HEADER
U2 = avr:MEGA128: MICROCONTROLLER 128 Kbytes FLASH 4 Kbytes SRAM 4 Kbytes EEPROM DUAL USART 8-channel 10 bit ADC
U4 = 74xx-eu:74*08: Quad 2-input AND gate
U10 = 40xx:4051: 8-channel ANALOG MULTIPLEXER
U11 = tlb:ADXL322JCP
U12 = burr-brown:INA2128: Dual Instrumentation Amplifier Low Power
U13 = linear:78*: Positive VOLTAGE REGULATOR
U14 = linear:78L*SMD: Positive VOLTAGE REGULATOR
UYAW = tlb:ADXRS150ABG
XKNOB = tlb:43045-0612
XSG = tlb:43045-0812

## Net classes
1 pwr: width 0.254 mm, drill 0.152 mm, clearance 0.406 mm
2 bigpwr: width 0.914 mm, clearance 0.813 mm
3 ugpwr: width 0.61 mm, clearance 0.61 mm

## Board
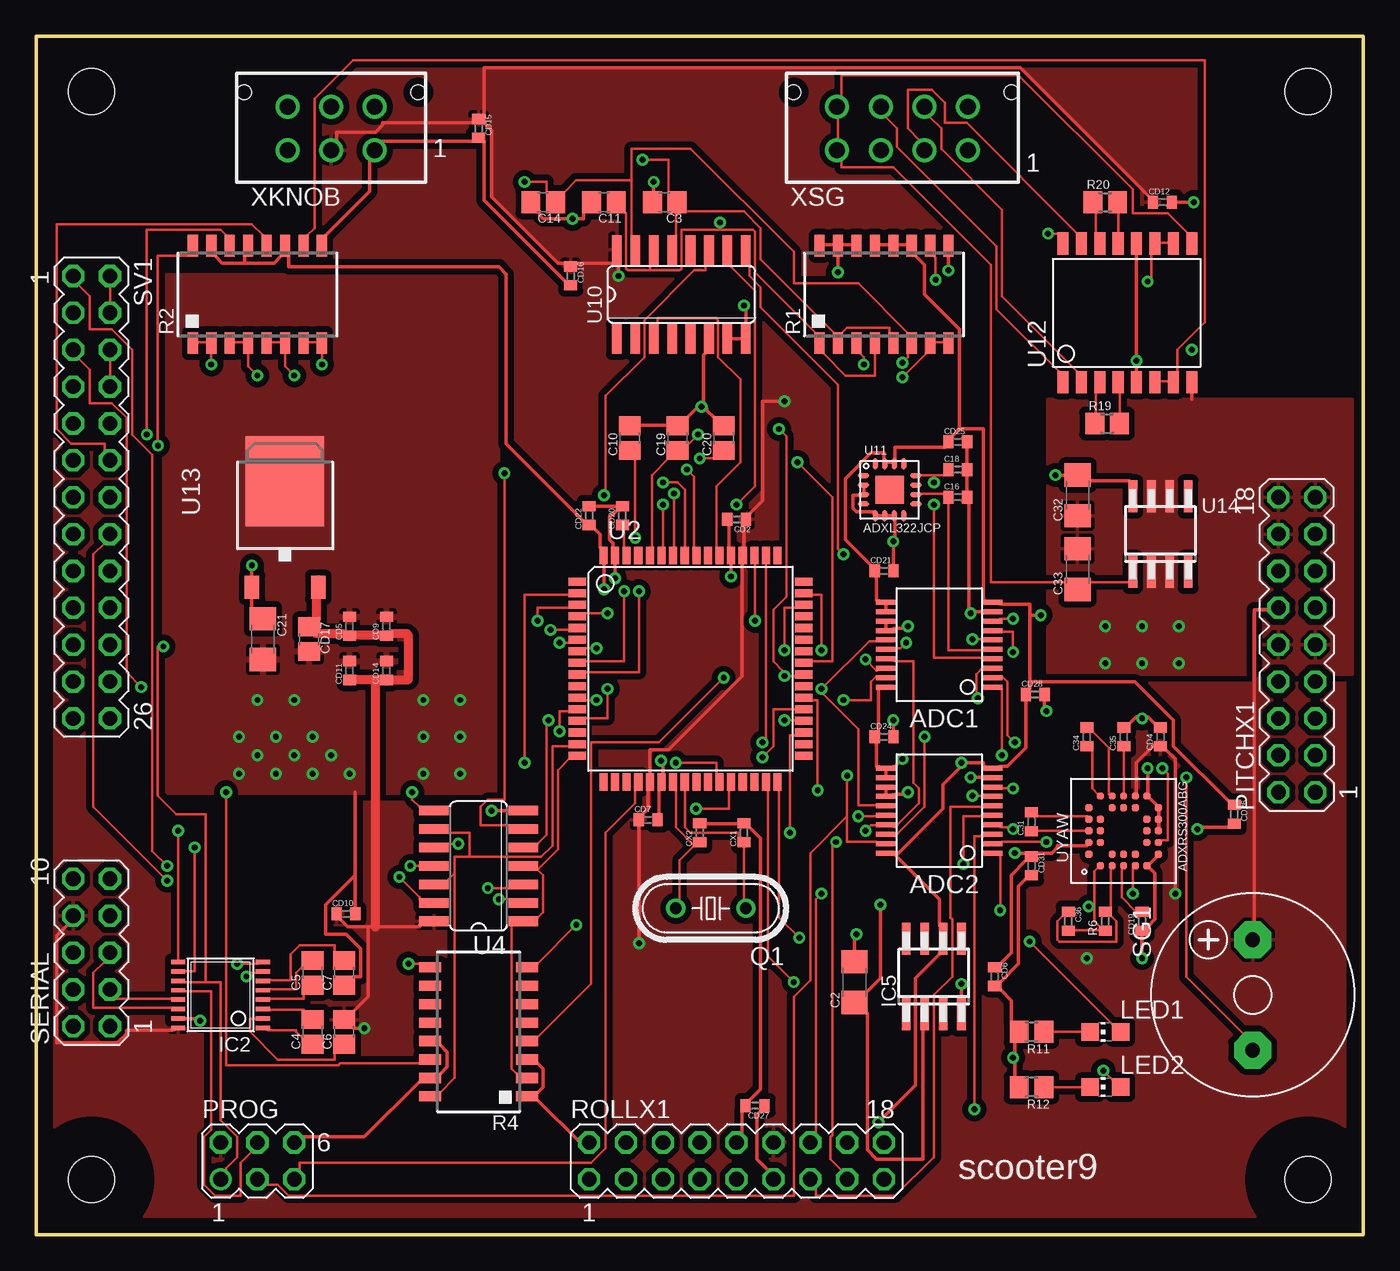
[diagram p5: board, top side]
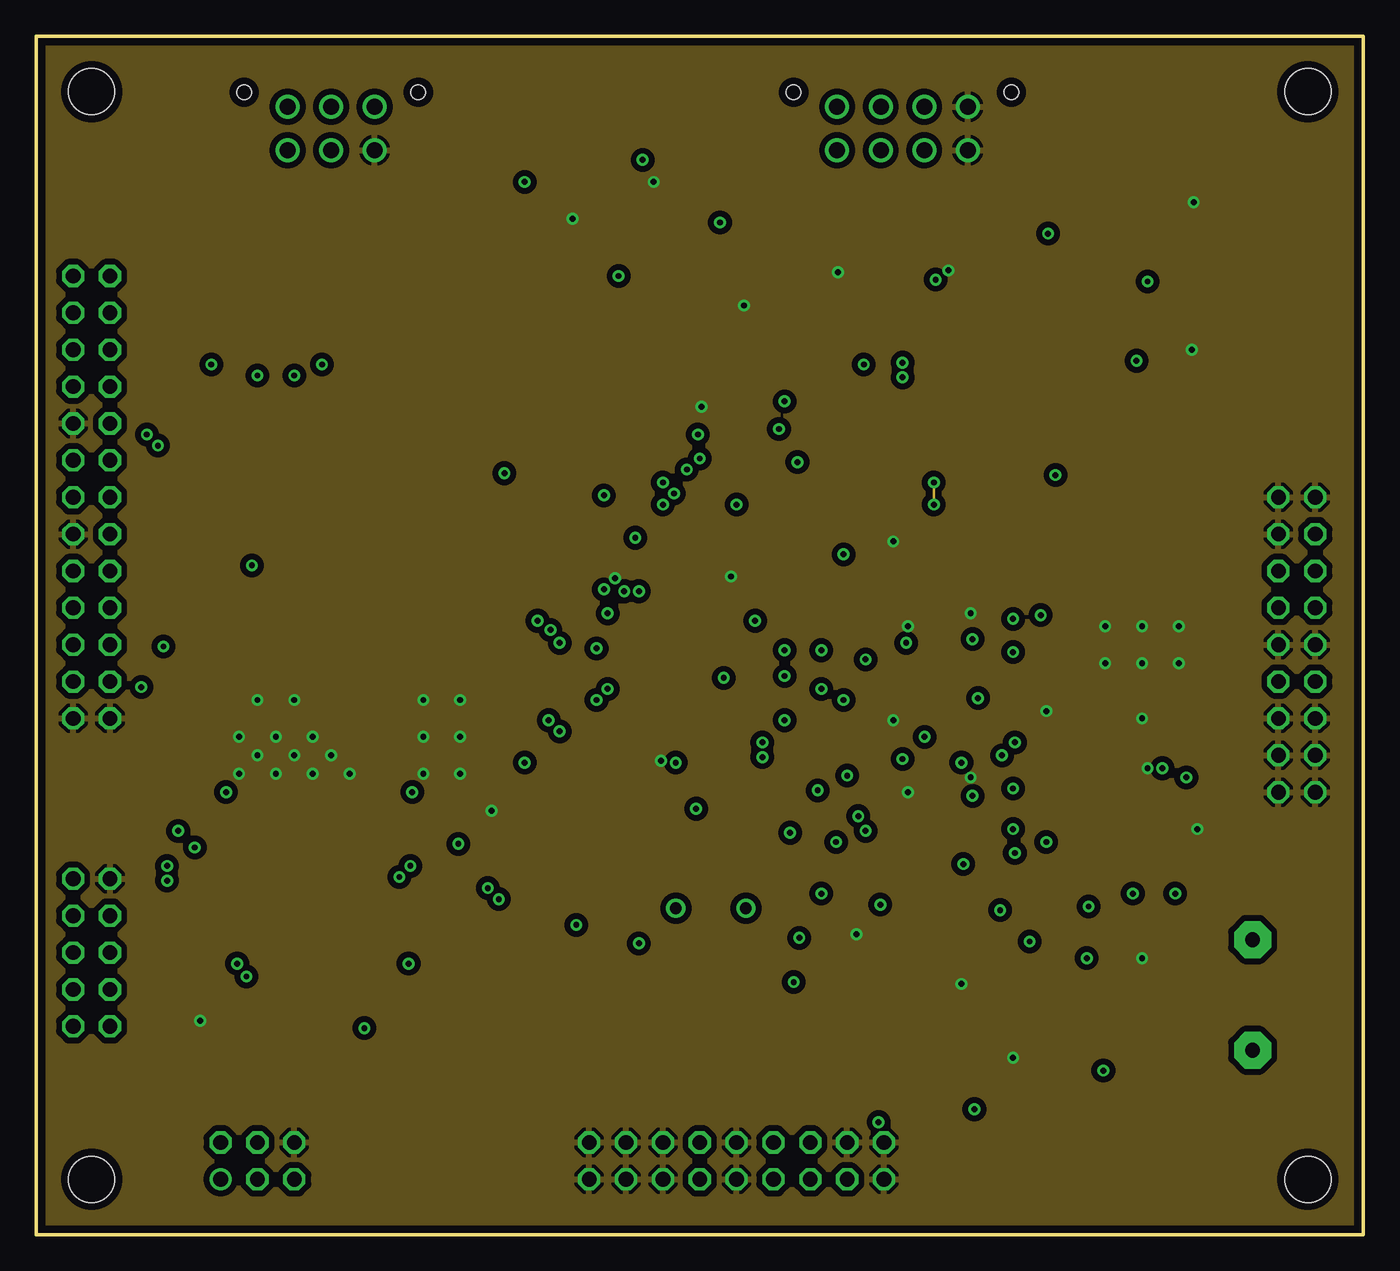
[diagram p6: board, inner layer Route2]
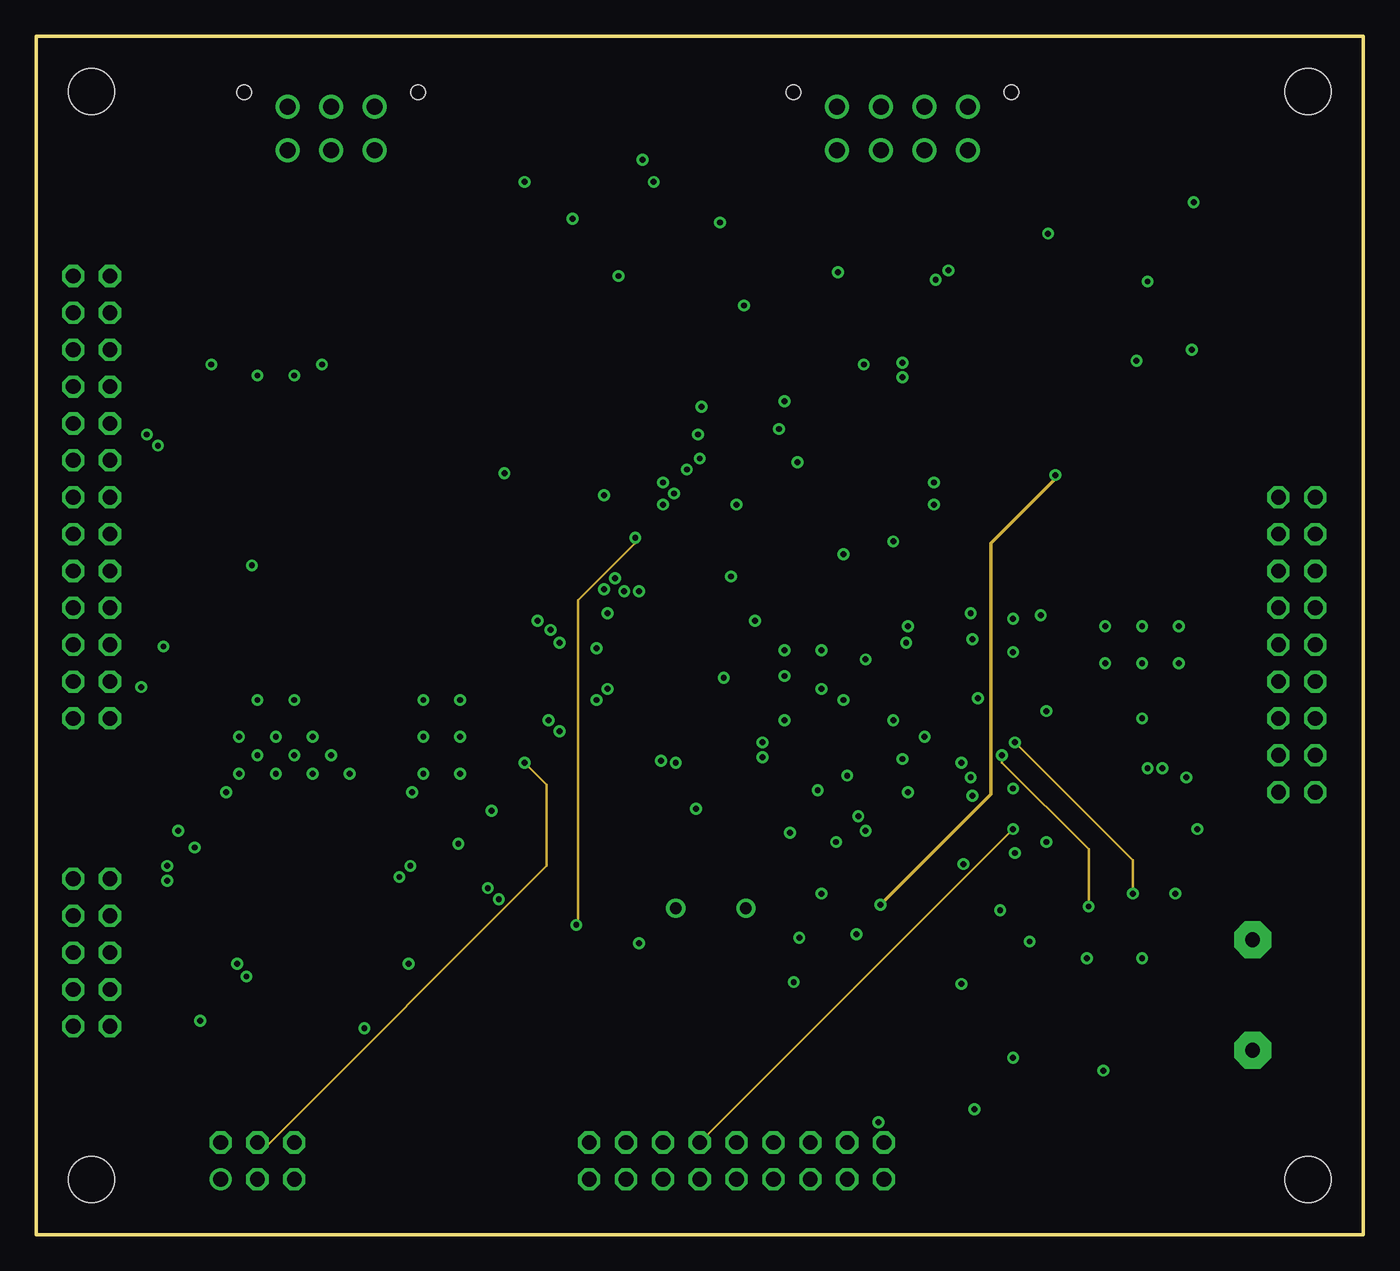
[diagram p7: board, inner layer Route15]
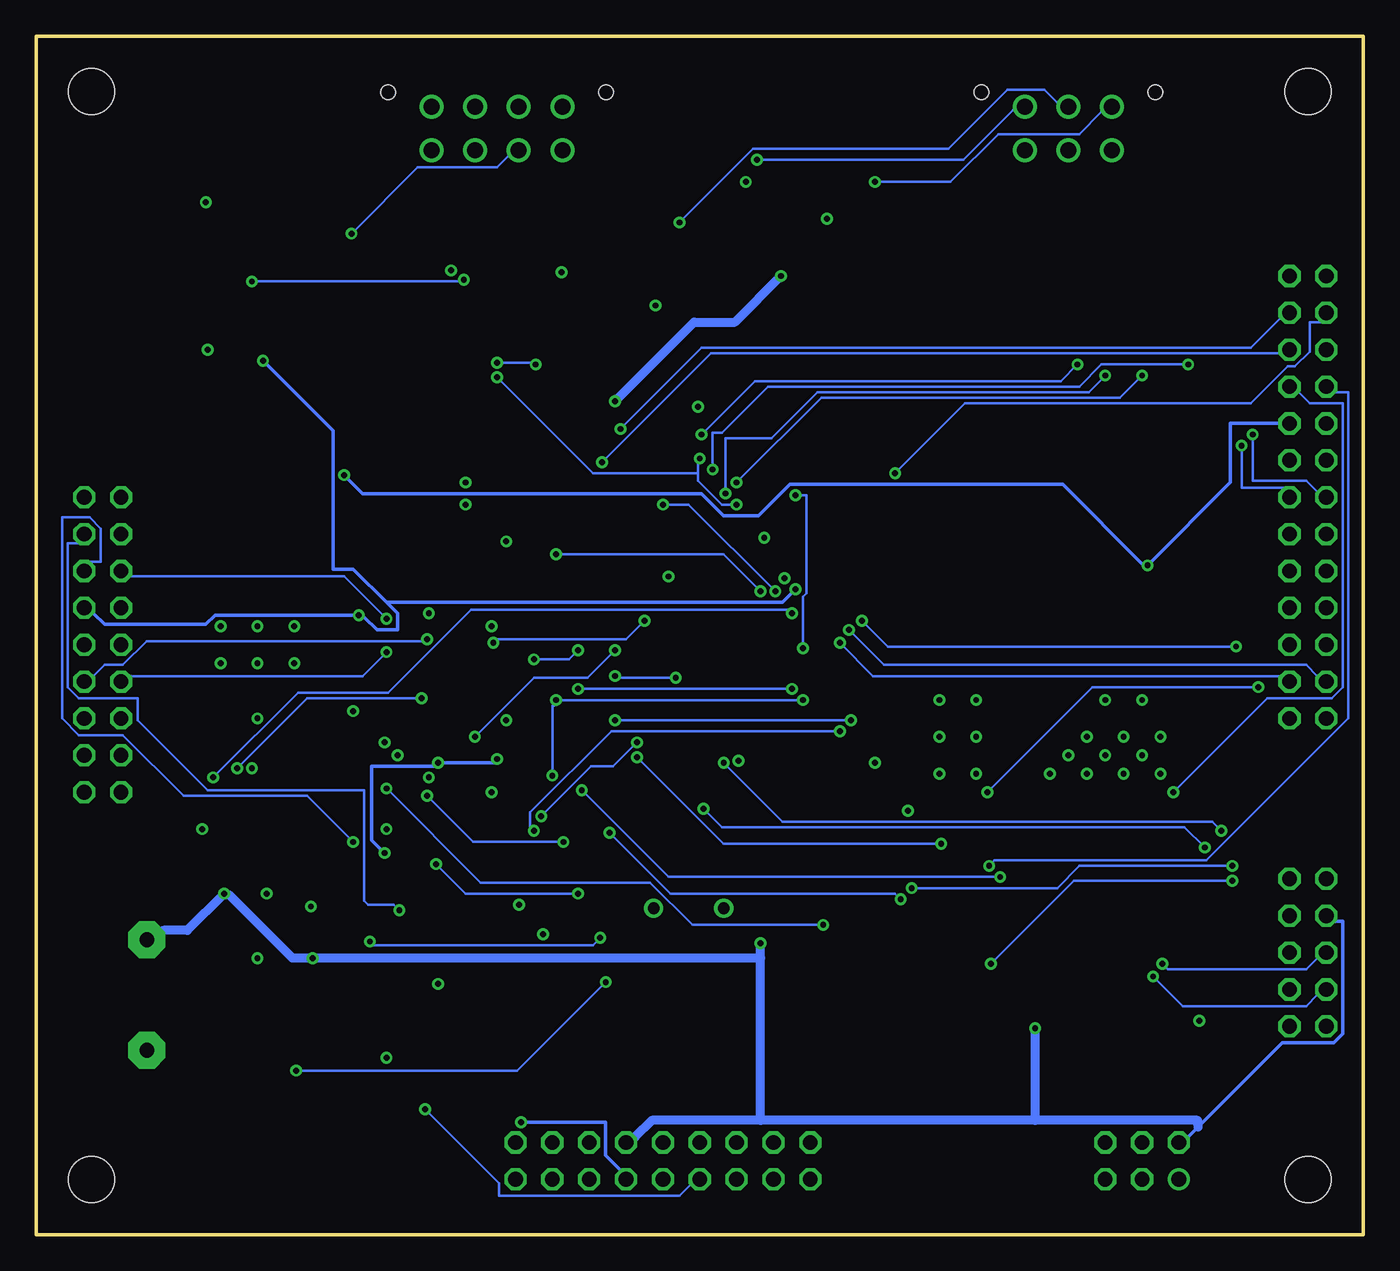
[diagram p8: board, bottom side, seen from below]

Size 91.44 x 82.55 mm. Coordinates in mm from the lower left corner, seen from the top.
Outline: 0,0 91.44,0 91.44,82.55 0,82.55 0,0
Copper layers (1*2+15*16): Top 0.035mm / dielectric 1.5mm / Route2 0.035mm / dielectric 0.15mm / Route15 0.035mm / dielectric 0.2mm / Bottom 0.035mm
Design rules "default": minimum track width 7mil, minimum drill 16mil, track to track 8mil, track to pad 8mil, pad to pad 8mil, via to via 8mil, smd to smd 8mil, copper to edge 20mil, drill to drill 8mil, minimum pad ring 10mil, minimum via ring 8mil, stop-mask expansion 4mil, vias tented up to drill 0mil, thermal gap 10mil
Holes 3.17 mm at 3.81,78.74 87.63,3.81 3.81,3.81 87.63,78.74
tRestrict: area 0,74.9 to 7.6,82.5; area 83.8,74.9 to 91.4,82.5; area 83.8,0 to 91.4,7.6; area 0,0 to 7.6,7.6
bRestrict: area 0,74.9 to 7.6,82.6; area 83.8,74.9 to 91.4,82.5; area 83.8,0 to 91.4,7.6; area 0,0 to 7.6,7.6

### Footprints (pad centres in the part's own frame; a part is rotated, then mirrored left to right if it is on the bottom)
SSOP20BU = smd 0.348 x 1.397: 1 -2.925,-3.656; 2 -2.275,-3.656; 3 -1.625,-3.656; 4 -0.975,-3.656; 5 -0.325,-3.656; 6 0.325,-3.656; 7 0.975,-3.656; 8 1.625,-3.656; 9 2.275,-3.656; 10 2.925,-3.656; 11 2.925,3.656; 12 2.275,3.656; 13 1.625,3.656; 14 0.975,3.656; 15 0.325,3.656; 16 -0.325,3.656; 17 -0.975,3.656; 18 -1.625,3.656; 19 -2.275,3.656; 20 -2.925,3.656
C1206 = smd 1.6 x 1.8: 1 -1.4,0; 2 1.4,0
C0805 = smd 1.3 x 1.5: 1 -0.85,0; 2 0.85,0
C0402 = smd 0.7 x 0.9: 1 -0.65,0; 2 0.65,0
TSSOP16 = smd 0.305 x 0.991: 1 -2.275,-2.918; 2 -1.625,-2.918; 3 -0.975,-2.918; 4 -0.325,-2.918; 5 0.325,-2.918; 6 0.975,-2.918; 7 1.625,-2.918; 8 2.275,-2.918; 9 2.275,2.918; 10 1.625,2.918; 11 0.975,2.918; 12 0.325,2.918; 13 -0.325,2.918; 14 -0.975,2.918; 15 -1.625,2.918; 16 -2.275,2.918
SO08 = smd 0.6 x 2.2: 1 -1.905,-2.6; 2 -0.635,-2.6; 3 0.635,-2.6; 4 1.905,-2.6; 5 1.905,2.6; 6 0.635,2.6; 7 -0.635,2.6; 8 -1.905,2.6
CHIP-LED0805 = smd 1.2 x 1.2: A 0,-1.05; C 0,1.05
MA09-2 = drill 1.016 octagon: 1 -10.16,-1.27; 2 -10.16,1.27; 3 -7.62,-1.27; 4 -7.62,1.27; 5 -5.08,-1.27; 6 -5.08,1.27; 7 -2.54,-1.27; 8 -2.54,1.27; 9 0,-1.27; 10 0,1.27; 11 2.54,-1.27; 12 2.54,1.27; 13 5.08,-1.27; 14 5.08,1.27; 15 7.62,-1.27; 16 7.62,1.27; 17 10.16,-1.27; 18 10.16,1.27
MA03-2 = drill 1.016 round: 1 -2.54,-1.27 | drill 1.016 octagon: 2 -2.54,1.27; 3 0,-1.27; 4 0,1.27; 5 2.54,-1.27; 6 2.54,1.27
HC49/S = drill 0.813 round: 1 -2.413,0; 2 2.413,0
4816P = smd 0.7 x 1.5: 1 -4.445,-3.346; 2 -3.175,-3.346; 3 -1.905,-3.346; 4 -0.635,-3.346; 5 0.635,-3.346; 6 1.905,-3.346; 7 3.175,-3.346; 8 4.445,-3.346; 9 4.445,3.346; 10 3.175,3.346; 11 1.905,3.346; 12 0.635,3.346; 13 -0.635,3.346; 14 -1.905,3.346; 15 -3.175,3.346; 16 -4.445,3.346
R0402 = smd 0.7 x 0.9: 1 -0.65,0; 2 0.65,0
R0805 = smd 1.3 x 1.5: 1 -0.85,0; 2 0.85,0
MA05-2 = drill 1.016 octagon: 1 -5.08,-1.27; 2 -5.08,1.27; 3 -2.54,-1.27; 4 -2.54,1.27; 5 0,-1.27; 6 0,1.27; 7 2.54,-1.27; 8 2.54,1.27; 9 5.08,-1.27; 10 5.08,1.27
F/CM12P = drill 1.016 pad 2.54 octagon: + 3.81,0; - -3.81,0
MA13-2 = drill 1.016 octagon: 1 -15.24,-1.27; 2 -15.24,1.27; 3 -12.7,-1.27; 4 -12.7,1.27; 5 -10.16,-1.27; 6 -10.16,1.27; 7 -7.62,-1.27; 8 -7.62,1.27; 9 -5.08,-1.27; 10 -5.08,1.27; 11 -2.54,-1.27; 12 -2.54,1.27; 13 0,-1.27; 14 0,1.27; 15 2.54,-1.27; 16 2.54,1.27; 17 5.08,-1.27; 18 5.08,1.27; 19 7.62,-1.27; 20 7.62,1.27; 21 10.16,-1.27; 22 10.16,1.27; 23 12.7,-1.27; 24 12.7,1.27; 25 15.24,-1.27; 26 15.24,1.27
TQFP64 = smd 1.194 x 0.559: 1 -7.8,6; 2 -7.8,5.2; 3 -7.8,4.4; 4 -7.8,3.6; 5 -7.8,2.8; 6 -7.8,2; 7 -7.8,1.2; 8 -7.8,0.4; 9 -7.8,-0.4; 10 -7.8,-1.2; 11 -7.8,-2; 12 -7.8,-2.8; 13 -7.8,-3.6; 14 -7.8,-4.4; 15 -7.8,-5.2; 16 -7.8,-6; 33 7.8,-6; 34 7.8,-5.2; 35 7.8,-4.4; 36 7.8,-3.6; 37 7.8,-2.8; 38 7.8,-2; 39 7.8,-1.2; 40 7.8,-0.4; 41 7.8,0.4; 42 7.8,1.2; 43 7.8,2; 44 7.8,2.8; 45 7.8,3.6; 46 7.8,4.4; 47 7.8,5.2; 48 7.8,6 | smd 0.559 x 1.194: 17 -6,-7.8; 18 -5.2,-7.8; 19 -4.4,-7.8; 20 -3.6,-7.8; 21 -2.8,-7.8; 22 -2,-7.8; 23 -1.2,-7.8; 24 -0.4,-7.8; 25 0.4,-7.8; 26 1.2,-7.8; 27 2,-7.8; 28 2.8,-7.8; 29 3.6,-7.8; 30 4.4,-7.8; 31 5.2,-7.8; 32 6,-7.8; 49 6,7.8; 50 5.2,7.8; 51 4.4,7.8; 52 3.6,7.8; 53 2.8,7.8; 54 2,7.8; 55 1.2,7.8; 56 0.4,7.8; 57 -0.4,7.8; 58 -1.2,7.8; 59 -2,7.8; 60 -2.8,7.8; 61 -3.6,7.8; 62 -4.4,7.8; 63 -5.2,7.8; 64 -6,7.8
SO14 = smd 0.66 x 2.032: 1 -3.81,-3.073; 2 -2.54,-3.073; 3 -1.27,-3.073; 4 0,-3.073; 5 1.27,-3.073; 6 2.54,-3.073; 7 3.81,-3.073; 8 3.81,3.073; 9 2.54,3.073; 10 1.27,3.073; 11 0,3.073; 12 -1.27,3.073; 13 -2.54,3.073; 14 -3.81,3.073
SO16 = smd 0.66 x 2.032: 1 -4.445,-3.073; 2 -3.175,-3.073; 3 -1.905,-3.073; 4 -0.635,-3.073; 5 0.635,-3.073; 6 1.905,-3.073; 7 3.175,-3.073; 8 4.445,-3.073; 9 4.445,3.073; 10 3.175,3.073; 11 1.905,3.073; 12 0.635,3.073; 13 -0.635,3.073; 14 -1.905,3.073; 15 -3.175,3.073; 16 -4.445,3.073
LFCSP16 = smd 0.8 x 0.35: 1 -1.8,0.975; 2 -1.8,0.325; 3 -1.8,-0.325; 4 -1.8,-0.975; 9 1.8,-0.975; 10 1.8,-0.325; 11 1.8,0.325; 12 1.8,0.975 | smd 0.35 x 0.8: 5 -0.975,-1.8; 6 -0.325,-1.8; 7 0.325,-1.8; 8 0.975,-1.8; 13 0.975,1.8; 14 0.325,1.8; 15 -0.325,1.8; 16 -0.975,1.8 | smd 1.95 x 1.95: 17 0,0
SO16-1 = smd 0.762 x 1.524: 1 -4.445,-4.775; 2 -3.175,-4.775; 3 -1.905,-4.775; 4 -0.635,-4.775; 5 0.635,-4.775; 6 1.905,-4.775; 7 3.175,-4.775; 8 4.445,-4.775; 9 4.445,4.775; 10 3.175,4.775; 11 1.905,4.775; 12 0.635,4.775; 13 -0.635,4.775; 14 -1.905,4.775; 15 -3.175,4.775; 16 -4.445,4.775
TO252 = smd 1 x 1.6: 1 -2.28,-4.8; 2 2.28,-4.8 | smd 5.4 x 6.2: 3 0,2.5
BC-32 = smd 0.5 x 0.5: A2 -1.6,2.4; A3 -0.8,2.4; A4 0,2.4; A5 0.8,2.4; A6 1.6,2.4; B1 -2.4,1.6; B3 -0.8,1.6; B4 0,1.6; B5 0.8,1.6; B7 2.4,1.6; C1 -2.4,0.8; C2 -1.6,0.8; C6 1.6,0.8; C7 2.4,0.8; D1 -2.4,0; D2 -1.6,0; D6 1.6,0; D7 2.4,0; E1 -2.4,-0.8; E2 -1.6,-0.8; E6 1.6,-0.8; E7 2.4,-0.8; F1 -2.4,-1.6; F3 -0.8,-1.6; F4 0,-1.6; F5 0.8,-1.6; F7 2.4,-1.6; G2 -1.6,-2.4; G3 -0.8,-2.4; G4 0,-2.4; G5 0.8,-2.4; G6 1.6,-2.4
43045-0612 = drill 1.1 round: 1 3,-1.5; 2 0,-1.5; 3 -3,-1.5; 4 3,1.5; 5 0,1.5; 6 -3,1.5 | hole 1: 6,2.5; -6,2.5
43045-0812 = drill 1.1 round: 1 4.5,-1.5; 2 1.5,-1.5; 3 -1.5,-1.5; 4 -4.5,-1.5; 5 4.5,1.5; 6 1.5,1.5; 7 -1.5,1.5; 8 -4.5,1.5 | hole 1: 7.5,2.5; -7.5,2.5

### Placement (x,y rotation side)
ADC1  62.23,40.64 90 top
ADC2  62.23,29.21 90 top
C2  56.39,17.4 90 top
C3  43.31,71.12 180 top
C4  19.05,13.97 90 top
C5  19.05,18.03 90 top
C6  21.21,13.97 90 top
C7  21.21,18.03 90 top
C10  40.89,54.86 90 top
C11  39.12,71.12 180 top
C14  34.92,71.12 180 top
C16  63.5,50.8 0 top
C18  63.5,52.7 0 top
C19  44.2,54.86 90 top
C20  47.37,54.86 90 top
C21  15.62,41.02 270 top
C31  68.58,28.45 90 top
C32  71.75,50.93 90 top
C33  71.75,45.85 90 top
C34  72.39,34.29 90 top
C35  74.93,34.29 90 top
C36  71.12,21.59 270 top
CD2  48.26,49.28 180 top
CD4  77.47,34.29 90 top
CD5  21.59,41.91 90 top
CD6  66.04,17.78 270 top
CD7  42.16,28.57 0 top
CD9  24.13,41.91 90 top
CD10  21.34,22.1 0 top
CD11  21.59,38.86 90 top
CD12  77.6,71.12 0 top
CD14  24.13,38.86 90 top
CD15  30.48,76.2 270 top
CD16  36.83,66.04 270 top
CD17  18.8,41.02 270 top
CD19  76.2,21.59 90 top
CD20  40.39,49.53 90 top
CD21  58.42,45.72 0 top
CD22  38.1,49.53 90 top
CD24  58.42,34.29 0 top
CD25  63.5,54.61 0 top
CD26  82.55,28.96 270 top
CD27  49.53,8.89 180 top
CD28  68.83,37.21 0 top
CD31  68.58,25.4 270 top
CX1  48.77,27.69 90 top
CX2  45.72,27.69 90 top
IC2  12.7,16.51 90 top
IC5  61.85,17.78 0 top
LED1  73.66,13.97 90 top
LED2  73.66,10.16 90 top
PITCHX1  86.87,40.64 90 top
PROG  15.24,5.08 0 top
Q1  46.48,22.48 180 top
R1  58.42,64.77 0 top
R2  15.24,64.77 0 top
R4  30.48,13.97 90 top
R6  73.66,21.59 90 top
R11  68.58,13.97 180 top
R12  68.58,10.16 180 top
R19  73.79,55.88 0 top
R20  73.66,71.12 0 top
ROLLX1  48.26,5.08 0 top
SERIAL  3.81,19.43 90 top
SG1  83.82,16.51 90 top
SV1  3.81,50.8 270 top
U2  45.09,38.99 0 top
U4  30.48,25.4 90 top
U10  44.45,64.77 0 top
U11  58.8,51.31 0 top
U12  75.18,63.5 0 top
U13  17.14,49.4 0 top
U14  77.47,48.26 0 top
UYAW  74.93,27.81 90 top
XKNOB  20.32,76.2 0 top
XSG  59.69,76.2 0 top

### Tracks (layer width: path | path; a pad name or v marks a point on that pad's centre or on a via)
+5V  (via drill 0.41)
  Top 0.254: 14.35,66.93 12.83,66.93 12.32,67.44 R2.15 | 14.35,66.93 14.35,67.44 R2.13 | 14.35,66.93 16.38,66.93 16.89,67.44 R2.11 17.4,67.44 17.4,66.67 31.88,66.67 32.38,66.17 32.38,54.48 37.72,49.15 CD22.1 38.48,48.64 38.86,48.26 38.86,47.37 U2.64 39.12,46.23 v39.12,44.45 | CD27.1 49.91,8.51 49.66,8.26 49.66,5.21 50.42,4.45 ROLLX1.11 | 59.24,26.1 62.23,23.11 62.23,21.46 IC5.6 62.23,19.3 60.58,17.65 60.58,10.29 v58.04,7.75 | 59.24,26.1 59.18,26.16 ADC2.20 | ADC1.12 58.55,43.05 58.55,43.43 ADC1.11 57.91,43.69 57.91,45.34 CD21.1 57.53,46.1 55.75,47.88 55.75,52.07 57.53,53.85 58.42,53.85 58.42,53.47 U11.15 58.55,53.21 59.05,53.21 U11.14 59.18,53.47 59.18,54.23 62.61,54.23 CD25.1 63.12,54.99 63.63,55.5 | R1.13 58.04,68.2 58.8,68.2 R1.12 59.31,68.2 60.07,68.2 R1.11 60.58,67.44 61.21,66.8 61.21,64.77 63.63,62.36 63.63,55.5 | UYAW.A3 72.39,26.8 70.36,26.8 70.36,26.67 69.98,26.29 68.96,26.29 CD31.1 | CD6.1 66.42,18.67 67.18,19.43 67.18,24.77 68.2,25.78 CD31.1 | U12.5 v75.82,60.2 U12.12 | ADC2.11 57.91,32.26 57.91,33.91 CD24.1 58.04,34.67 58.04,37.59 ADC1.20 | ADC2.12 58.55,31.62 58.55,32 ADC2.11 | 68.45,38.1 75.69,38.1 78.36,35.43 78.36,33.66 82.17,29.84 CD26.1 | 68.45,38.1 68.45,37.59 CD28.1 68.2,36.83 68.2,33.53 66.93,32.26 66.55,32.26 ADC2.10 65.28,32.26 65.28,32.51 v63.75,32.51 63.63,32.13 62.48,30.99 62.48,29.34 59.24,26.1 | 68.45,38.1 68.45,42.67 | 68.45,42.67 68.45,43.43 66.55,43.43 ADC1.10 65.28,43.69 65.28,55.5 63.63,55.5 | 68.45,42.67 v69.22,42.67 | v59.69,32.77 59.18,32.26 ADC2.11 | v67.44,26.29 68.2,26.29 CD31.1
  Bottom 0.254: v58.04,7.75 52.2,7.75 52.2,5.46 51.18,4.45 ROLLX1.11 | PITCHX1.11 87.5,42.8 86.74,42.04 79.76,42.04 79.12,42.67 v69.22,42.67 68.83,42.55 67.94,41.66 66.55,41.66 66.55,42.8 67.25,43.5 | v59.69,32.77 59.94,32.51 v63.75,32.51 64.01,32.26 68.33,32.26 68.33,27.18 v67.44,26.29 | v75.82,60.2 70.99,55.37 70.99,45.85 69.6,45.85 67.25,43.5 | v39.12,44.45 40.01,43.56 67.18,43.56 67.25,43.5
+15V  (via drill 0.41)
  Top 0.254: IC5.2 61.09,14.1 61.09,5.21 57.91,5.21 57.28,5.84 57.28,15.24 C2.1 57.28,16.76 58.17,17.65 v58.17,22.73 | U14.8 75.31,51.94 72.64,51.94 C32.2 70.87,52.32 v70.23,52.32 | C21.1 14.86,43.18 14.86,43.81 U13.1 14.86,45.34 v14.86,46.1
  Route15 0.254: v58.17,22.73 65.79,30.35 65.79,47.62 70.1,51.94 v70.23,52.32
  Bottom 0.254: SV1.10 9.14,55.88 9.14,51.82 v14.86,46.1 15.24,46.23 20.7,51.69 39.5,51.69 41.66,49.53 44.07,49.53 45.59,51.05 68.96,51.05 v70.23,52.32
/RESET
  Top 0.178: U2.20 41.27,30.61 41.27,29.72 39.24,27.69 39.24,5.97 38.23,4.95 18.16,4.95 18.16,4.45 PROG.5
ADCMUX1
  Top 0.178: U2.54 46.86,47.37 46.86,51.56 48.51,53.21 48.51,58.93 46.99,60.45 46.99,62.99 46.86,63.12 42.8,63.12 42.8,62.61 U10.3
AREF
  Top 0.178: CD20.1 40.51,48.64 40.51,47.37 U2.62
BAT_VOLTAGE  (via drill 0.41)
  Top 0.178: v67.31,30.73 66.55,30.73 ADC2.8 | v37.21,21.34 34.54,18.67 R4.8 | v41.27,48.01 41.27,53.47 C10.1
  Route15 0.178: v41.27,48.01 41.27,47.62 37.34,43.69 37.34,21.72 v37.21,21.34
  Bottom 0.178: v67.31,30.73 60.83,24.26 49.15,24.26 46.23,21.34 v37.21,21.34
BATIS  (via drill 0.41)
  Top 0.178: v44.83,52.7 45.34,52.2 45.34,47.37 U2.56 | v12.06,59.94 R2.2 11.81,61.47 11.05,61.47 R2.1
  Bottom 0.178: v44.83,52.7 44.83,55.24 44.2,55.24 41.02,58.42 19.56,58.42 18.03,59.94 v12.06,59.94
BATISIN  (via drill 0.41)
  Top 0.178: v8.38,54.36 8.38,67.44 10.54,67.44 R2.16
  Bottom 0.178: v8.38,54.36 8.38,51.44 5.46,51.44 SV1.14
BEEPER  (via drill 0.41)
  Top 0.178: v39.37,42.8 37.85,42.8 U2.4 | v79.25,31.5 79.25,17.78 83.19,13.84 SG1.-
  Bottom 0.178: v39.37,42.8 39.62,43.05 61.47,43.05 67.18,37.34 73.41,37.34 v79.25,31.5
EXTRAMUX0  (via drill 0.41)
  Top 0.178: v38.61,40.39 37.85,40.39 U2.7 | v39.12,50.93 39.24,51.05 39.24,57.78 41.91,60.45 41.91,62.99 45.34,66.42 46.1,66.42 46.1,66.93 U10.11
  Bottom 0.178: v38.61,40.39 38.61,43.94 38.35,44.2 38.35,50.93 v39.12,50.93
EXTRAMUX1  (via drill 0.41)
  Top 0.178: v40.51,44.32 40.51,39.5 37.85,39.5 U2.8 | v48.26,50.29 49.53,51.56 49.53,65.02 47.88,66.67 47.88,66.93 U10.10
  Bottom 0.178: v40.51,44.32 46.48,50.29 v48.26,50.29
EXTRAMUX2  (via drill 0.41)
  Top 0.178: v41.53,44.32 41.53,38.73 37.85,38.73 U2.9 | v55.63,46.86 55.24,47.24 55.24,58.55 49.91,63.88 49.91,65.28 49.15,66.04 49.15,66.93 U10.9
  Bottom 0.178: v41.53,44.32 44.07,46.86 v55.63,46.86
GND  (via drill 0.41)
  Top 0.254: 21.97,24.77 21.97,22.48 CD10.2 | 21.97,24.77 21.97,30.48 | 21.97,24.77 19.94,22.73 19.94,20.7 21.34,20.7 22.35,19.68 22.35,17.78 21.84,17.78 C7.1 | CD16.2 36.45,65.66 30.86,71.25 30.86,75.31 CD15.2 30.1,75.31 23.75,75.31 XKNOB.1 22.99,73.91 22.99,71.88 19.94,68.83 R2.9 | CD31.2 68.2,24.51 67.69,24 67.69,18.67 66.42,17.4 CD6.2 66.42,16.89 67.18,16.13 67.18,14.61 R11.2 67.44,13.34 67.44,12.57 v67.31,12.19 67.44,11.81 67.44,10.79 R12.2 | C14.2 34.67,70.48 34.67,70.23 34.92,69.98 v36.96,69.98 37.72,69.98 37.72,70.48 C11.2 | C10.2 41.53,55.75 43.56,55.75 C19.2 44.83,56.26 45.47,56.9 v45.85,57.02 | U10.7 47.88,61.72 48.64,61.72 U10.8 48.9,63.63 v48.77,64.01 | R4.13 27.81,13.08 28.32,12.57 28.32,11.56 27.81,11.05 R4.15 26.42,10.54 22.61,6.73 18.41,6.73 PROG.6 | R4.3 34.54,11.81 34.92,11.43 34.92,10.16 34.54,9.78 R4.1 34.54,9.27 37.47,6.35 ROLLX1.2 | R1.16 54.23,68.2 54.99,68.2 R1.15 | R1.14 56.26,68.2 55.5,68.2 R1.15 | U11.2 57.02,51.56 57.02,51.05 U11.3 56.64,50.93 56.26,50.93 56.26,50.04 56.52,49.78 57.66,49.78 U11.5 57.91,49.53 58.42,49.53 U11.6 58.55,49.53 59.05,49.53 U11.7 59.18,49.15 59.18,48.13 v59.05,47.75 59.05,46.1 CD21.2 | CD25.2 64.14,54.23 64.14,53.09 C18.2 64.14,52.32 64.14,51.18 C16.2 64.26,50.42 64.26,43.18 v64.39,42.8 64.77,42.93 65.28,42.93 ADC1.9 | CD7.2 42.93,28.96 42.93,30.61 U2.22 43.18,31.75 43.18,32.26 v43.05,32.64 | CD2.2 47.75,48.9 47.75,47.37 U2.53 47.88,46.23 v47.88,45.34 | CX2.2 46.1,28.32 48.39,28.32 CX1.2 49.15,28.07 49.91,27.3 49.91,10.03 49.15,9.27 CD27.2 48.64,8.51 48.64,6.99 ROLLX1.10 | CD22.2 38.48,50.16 40.01,50.16 CD20.2 40.01,49.91 39.5,49.4 39.5,47.88 39.75,47.62 39.75,47.37 U2.63 39.88,46.23 v39.88,45.21
  Top 0.254: ADC1.13 58.55,42.16 58.55,41.78 ADC1.14 59.18,41.78 59.69,41.78 v60.07,41.91 | ADC2.13 58.55,30.73 58.55,30.35 ADC2.14 59.18,30.35 59.69,30.35 v60.07,30.48 | UYAW.G4 77.34,27.94 77.34,28.45 UYAW.G5 77.34,28.83 77.34,29.21 UYAW.G6 77.22,29.59 76.71,30.1 UYAW.F7 76.58,30.35 v76.58,32.13 | UYAW.G2 77.22,26.04 76.71,25.53 UYAW.F1 76.71,25.27 77.09,24.89 77.09,21.72 76.58,21.21 CD19.1 v76.2,19.05 | v59.05,35.43 59.05,34.67 CD24.2 | CD28.2 69.47,36.83 69.47,36.45 v69.6,36.07 | CD26.2 82.17,28.07 80.39,28.07 v80.01,27.94 | C35.2 75.31,35.18 75.82,35.69 v76.2,35.56 76.58,35.69 77.09,35.18 CD4.2 | CD12.2 v79.76,71.12 | IC2.15 10.16,14.86 10.92,14.86 v11.3,14.73 | ADC2.9 65.28,31.5 v64.39,31.5 | v42.55,72.52 42.55,71.75 C3.2 | C20.2 46.74,56.26 46.23,56.77 46.23,56.9 v45.85,57.02 | R1.9 v62.87,66.42 | 79.63,57.53 U12.8 | C2.2 56.39,20.32 v56.52,20.7 | v31.37,29.21 U4.7 | U10.6 46.1,60.71 45.97,60.58 45.97,57.4 v45.85,57.02 | IC5.4 v63.75,17.27 | R1.15 v55.24,66.29
  other vias: 76.2,41.91 78.74,41.91 78.74,39.37 76.2,39.37 73.66,41.91 73.66,39.37 79.63,60.96 21.59,31.75 19.05,31.75 16.51,31.75 13.97,31.75 13.97,34.29 16.51,34.29 19.05,34.29 17.78,36.83 15.24,36.83 17.78,33.02 15.24,33.02 20.32,33.02 26.67,34.29 26.67,31.75 29.21,34.29 29.21,31.75 29.21,36.83 26.67,36.83
  pour Route2 (isolate 0.254): 0,82.55 91.44,82.55 91.44,0 0,0
  pour Top: 8.89,66.04 31.75,66.04 31.75,30.48 8.89,30.48
  pour Top: 69.72,57.53 69.72,38.61 90.68,38.61 90.68,57.53
  pour Top (no thermals): 13.34,56.13 13.34,47.62 21.08,47.62 21.08,56.13
  pour Top: 75.44,52.32 75.44,44.2 79.63,44.2 79.63,52.32
  pour Top (no thermals): 75.82,53.21 75.82,44.07 79.25,44.07 79.25,53.21
KNOB1  (via drill 0.41)
  Top 0.178: R1.5 58.8,62.1 58.8,62.48 55.88,62.48 55.5,62.1 R1.2 54.99,62.1 49.91,67.18 49.91,69.34 48.77,70.48 44.7,70.48 C3.1 | C3.1 44.07,70.48 44.07,68.83 U10.13 | v41.78,74.04 43.56,74.04 43.56,71.75 C3.1
  Bottom 0.178: v41.78,74.04 27.56,74.04 24.13,77.47 XKNOB.4
KNOB2  (via drill 0.41)
  Top 0.178: R1.4 57.78,59.18 55.75,59.18 54.23,60.71 R1.1 53.72,62.1 49.53,66.29 49.53,69.09 49.4,69.22 47.12,69.22 | 42.29,66.42 40.77,66.42 40.64,66.55 40.64,70.36 40.51,70.48 C11.1 | 42.29,66.42 42.29,66.93 U10.14 | 47.12,69.22 44.45,69.22 44.45,66.55 44.32,66.42 42.29,66.42 | v47.12,69.72 47.12,69.22
  Bottom 0.178: v47.12,69.72 42.04,74.8 28.57,74.8 24.51,78.87 21.97,78.87 21.08,77.98 XKNOB.5
KNOB3  (via drill 0.41)
  Top 0.178: v57.02,59.94 57.02,60.45 56.77,60.71 R1.3 | v59.69,60.07 60.07,60.45 60.07,60.71 R1.6 60.07,62.1 56.64,65.53 52.2,65.53 52.2,67.69 45.09,74.8 41.02,74.8 41.02,72.64 | 41.02,72.64 37.21,72.64 36.32,71.75 C14.1 35.18,71.75 35.18,72.52 v33.66,72.52 | 41.02,72.64 41.02,68.83 U10.15
  Bottom 0.178: v57.02,59.94 57.15,60.07 v59.69,60.07 | v33.66,72.52 28.45,72.52 25.15,75.82 19.56,75.82 18.03,77.34 XKNOB.6
L_PWM_ENABLE  (via drill 0.41)
  Top 0.178: SV1.4 SV1.2 | v47.37,38.35 42.93,33.91 38.23,33.91 38.23,17.27 34.54,13.59 R4.4 | U2.40 52.32,38.48 v51.56,38.48 51.44,38.86 50.8,39.5 50.8,43.05 51.69,43.94 51.69,54.99 v51.18,55.5
  Bottom 0.178: v51.56,38.48 51.44,38.35 v47.37,38.35 | v51.18,55.5 45.59,61.09 7.75,61.09 5.71,63.12 SV1.4
L_PWM_FWD  (via drill 0.41)
  Top 0.178: v51.94,27.69 51.94,34.42 52.32,34.42 U2.35 | v31.88,23.11 32.64,23.11 U4.2
  Bottom 0.178: v51.94,27.69 47.75,23.5 32.26,23.5 v31.88,23.11
L_PWM_REV  (via drill 0.41)
  Top 0.178: v51.56,35.43 52.32,35.43 U2.36 | v35.31,35.43 35.18,35.31 35.18,27.56 34.54,26.92 U4.5
  Bottom 0.178: v35.31,35.43 v51.56,35.43
LED1  (via drill 0.41)
  Top 0.178: v52.58,20.45 51.18,21.84 51.18,30.61 U2.32 | v68.45,20.19 74.17,14.48 LED1.A
  Bottom 0.178: v52.58,20.45 53.09,19.94 68.2,19.94 v68.45,20.19
LED2  (via drill 0.41)
  Top 0.178: v52.2,17.4 50.42,19.18 50.42,30.61 U2.31 | v73.53,11.3 74.17,10.67 LED2.A
  Bottom 0.178: v52.2,17.4 58.29,11.3 v73.53,11.3
LMIS  (via drill 0.41)
  Top 0.178: v43.94,51.05 43.94,47.37 U2.58 | v17.78,59.18 17.14,59.82 R2.6 16.89,61.47 16.13,61.47 R2.5
  Bottom 0.178: v43.94,51.05 43.94,54.86 40.77,54.86 37.59,58.04 18.92,58.04 v17.78,59.18
LMISIN
  Top 0.178: R2.12 15.62,68.83 14.86,69.6 1.4,69.6 1.4,55.5 2.41,54.48 4.7,54.48 4.7,53.98 SV1.12
MCUXTAL1
  Top 0.178: Q1.1 48.77,23.11 CX1.1 48.39,27.3 48.39,27.69 45.09,27.69 44.7,28.07 44.7,30.61 U2.24
MCUXTAL2
  Top 0.178: 45.34,26.8 44.32,25.78 44.32,23.11 Q1.2 | 45.34,26.8 44.07,28.07 44.07,30.61 U2.23 | 45.34,26.8 CX2.1
N$1
  Top 0.178: R19.1 73.03,56.52 73.03,58.04 U12.3
N$3
  Top 0.178: UYAW.D1 74.8,25.27 74.8,23.24 75.82,22.23 CD19.2
N$8
  Top 0.178: R2.10 18.67,68.83 19.18,69.34 19.18,78.23 21.84,80.9 80.52,80.9 80.52,62.87 78.61,60.96 78.61,59.44 U12.7 78.11,58.8 77.34,58.8 U12.6
N$9  (via drill 0.41)
  Top 0.178: v61.98,65.79 61.98,67.31 61.85,67.44 R1.10 | v76.58,65.66 76.83,65.91 76.83,67.56 U12.11 77.34,68.33 78.11,68.33 U12.10
  Bottom 0.178: v61.98,65.79 62.1,65.66 v76.58,65.66
N$10
  Top 0.178: R19.2 74.68,56.52 74.68,58.04 U12.4
N$11
  Top 0.178: IC2.1 16,14.1 17.91,14.1 17.91,13.97 18.41,13.46 C4.1
N$12
  Top 0.178: IC2.4 16,16.26 18.41,16.26 18.41,16.64 C5.1
N$13
  Top 0.178: R20.2 74.55,70.48 U12.13
N$14
  Top 0.178: R11.1 LED1.C
N$15
  Top 0.178: R20.1 73.03,70.48 73.03,68.96 U12.14
N$16
  Top 0.178: R12.1 LED2.C
N$17
  Top 0.178: U12.1 70.48,59.44 66.17,63.75 66.17,68.07 59.31,74.93 59.31,76.2 58.55,76.96 XSG.7
N$18
  Top 0.178: U12.2 71.75,59.44 66.55,64.64 66.55,70.61 62.36,74.8 62.36,76.2 61.59,76.96 XSG.6
N$19  (via drill 0.41)
  Top 0.178: v69.72,68.96 70.48,68.96 U12.16
  Bottom 0.178: v69.72,68.96 65.15,73.53 59.69,73.53 58.93,74.3 XSG.3
N$20
  Top 0.178: IC2.5 16,16.89 17.91,16.89 17.91,18.03 18.41,18.54 C5.2
N$21
  Top 0.178: U12.15 71.75,68.96 64.14,76.58 62.61,76.58 62.61,77.98 61.72,78.87 60.07,78.87 60.07,76.2 60.83,75.44 XSG.2
N$22
  Top 0.178: IC2.3 16,15.49 18.41,15.49 18.41,15.37 C4.2
N$24
  Top 0.178: IC2.2 15.24,14.86 14.73,14.86 14.73,13.97 16.64,12.06 20.57,12.06 20.57,12.57 C6.1
N$26
  Top 0.178: IC2.6 16,17.53 17.53,17.53 17.53,19.3 18.16,19.94 20.57,19.94 20.57,19.43 C7.2
N$33
  Top 0.178: IC2.14 9.4,15.62 3.94,15.62 3.94,18.03 4.7,18.8 SERIAL.5
N$34
  Top 0.178: IC2.13 9.4,16.26 5.46,16.26 SERIAL.3
N$35  (via drill 0.41)
  Top 0.178: v14.48,17.78 14.48,18.03 15.24,18.03 IC2.7
  Bottom 0.178: v14.48,17.78 12.45,15.75 3.94,15.75 3.17,16.51 SERIAL.4
N$36  (via drill 0.41)
  Top 0.178: v13.84,18.67 15.24,18.67 IC2.8
  Bottom 0.178: v13.84,18.67 13.46,18.29 3.94,18.29 3.17,19.05 SERIAL.6
N$41
  Top 0.178: UYAW.B7 73.15,30.35 72.77,30.73 72.77,33.4 C34.1
N$42
  Top 0.178: UYAW.D7 C35.1
N$43
  Top 0.178: UYAW.C1 74.04,25.27 74.04,22.48 R6.2 74.04,21.97 74.42,21.59 74.42,20.19 70.48,20.19 70.36,20.32 70.36,21.59 70.74,21.97 C36.1
N$44
  Top 0.178: UYAW.C7 73.91,30.35 73.91,33.53 72.77,34.67 C34.2
N$45
  Top 0.178: UYAW.A4 68.96,27.81 C31.1
N$46
  Top 0.178: UYAW.A5 72.39,28.83 68.96,28.83 C31.2
OC1A
  Top 0.178: 34.54,25.15 35.94,26.54 35.94,32 36.7,32.77 U2.16 | R4.2 33.15,11.05 32.77,11.43 32.77,21.34 U4.1 34.54,21.84 34.92,22.23 34.92,24.77 34.54,25.15 | 34.54,25.15 U4.4
OC1B
  Top 0.178: 29.84,26.04 28.83,26.04 28.83,24.89 | 29.84,26.04 34.8,26.04 35.56,26.8 35.56,33.66 36.7,33.66 U2.15 | 28.83,24.89 28.32,24.38 U4.12 | 28.83,24.89 28.83,10.79 27.81,9.78 R4.16 | 29.84,26.04 29.84,27.69 28.32,27.69 U4.9
OC3A  (via drill 0.41)
  Top 0.178: v35.43,41.66 36.7,41.66 U2.5
  Bottom 0.178: v35.43,41.66 33.02,39.24 3.94,39.24 3.17,38.48 SV1.23
OC3B  (via drill 0.41)
  Top 0.178: v36.07,40.77 36.7,40.77 U2.6
  Bottom 0.178: v36.07,40.77 33.78,38.48 5.71,38.48 SV1.24
PA0  (via drill 0.41)
  Top 0.178: v49.53,42.29 49.53,46.23 U2.51 | v59.94,40.77 59.56,40.39 59.18,40.39 ADC1.16
  Bottom 0.178: v49.53,42.29 50.8,41.02 59.69,41.02 v59.94,40.77
PA1  (via drill 0.41)
  Top 0.178: v50.04,33.91 50.29,34.16 50.29,46.23 U2.50 | v56.64,28.83 57.91,28.83 ADC2.16
  Bottom 0.178: v50.04,33.91 51.69,32.26 53.21,32.26 v56.64,28.83
PA4  (via drill 0.41)
  Top 0.178: v54.1,40.26 54.1,44.07 53.47,44.07 U2.47 | v57.15,39.62 57.91,38.86 ADC1.18
  Bottom 0.178: v54.1,40.26 54.74,39.62 v57.15,39.62
PA5  (via drill 0.41)
  Top 0.178: v51.56,40.26 51.56,43.18 52.32,43.18 U2.46 | v61.21,34.29 61.21,29.46 59.18,27.43 ADC2.18
  Bottom 0.178: v51.56,40.26 53.47,38.35 57.15,38.35 v61.21,34.29
PB1  (via drill 0.41)
  Top 0.178: v38.61,36.83 37.85,36.83 U2.11 | v55.63,36.83 57.53,36.83 57.53,38.1 57.91,38.48 ADC1.19 | 55.88,28.83 v55.88,31.62 | 55.88,28.83 55.88,27.05 57.91,27.05 ADC2.19 | 55.88,28.83 53.34,26.29 53.34,17.53 52.2,16.38 52.2,2.67 17.4,2.67 16.64,3.43 15.88,3.43 PROG.3
  Bottom 0.178: v38.61,36.83 v55.63,36.83 55.75,36.45 55.88,36.45 v55.88,31.62
PB2  (via drill 0.41)
  Top 0.178: v36.07,34.67 36.07,36.07 36.7,36.07 U2.12 | v57.15,27.81 57.53,28.19 57.91,28.19 ADC2.17 59.18,28.07 60.83,29.72 60.83,30.73 60.45,31.11 60.45,39.5 59.18,39.5 ADC1.17
  Bottom 0.178: v36.07,34.67 51.82,34.67 57.4,29.08 57.4,27.81 v57.15,27.81
PB3  (via drill 0.41)
  Top 0.178: v39.37,37.59 39.37,35.56 37.85,35.56 U2.13 | ADC1.15 57.91,40.89 57.4,40.89 v54.1,37.59 54.23,37.21 56.64,34.8 56.64,29.59 57.91,29.59 ADC2.15
  Bottom 0.178: v39.37,37.59 v54.1,37.59
PITCH_AX  (via drill 0.41)
  Top 0.178: v69.6,27.05 66.55,27.05 ADC2.2
  Bottom 0.178: v69.6,27.05 72.77,30.23 81.28,30.23 85.47,34.42 88.52,34.42 89.66,35.56 89.66,49.4 87.76,49.4 87,48.64 87,46.35 87.76,46.35 PITCHX1.13
PITCH_AY  (via drill 0.41)
  Top 0.178: v66.42,22.35 66.42,26.16 ADC2.1
  Bottom 0.178: v66.42,22.35 66.8,22.73 68.58,22.73 68.83,22.99 68.83,30.61 79.63,30.61 84.45,35.43 84.45,36.96 88.52,36.96 89.28,37.72 89.28,47.62 88.52,47.62 PITCHX1.15
PITCH_RATE  (via drill 0.41)
  Top 0.178: v64.52,41.02 65.28,41.02 ADC1.6
  Bottom 0.178: v64.52,41.02 64.64,40.89 83.82,40.89 85.47,39.24 86.74,39.24 87.5,38.48 PITCHX1.7
PITCH_TEMP  (via drill 0.41)
  Top 0.178: v67.31,42.42 66.55,42.42 ADC1.8
  Bottom 0.178: v67.31,42.42 70.23,45.34 84.96,45.34 PITCHX1.14
PITCH_VREF  (via drill 0.41)
  Top 0.178: v67.31,40.13 67.31,41.53 66.55,41.53 ADC1.7
  Bottom 0.178: v67.31,40.13 68.96,38.48 84.96,38.48 PITCHX1.8
PWMA  (via drill 0.41)
  Top 0.178: v31.11,23.88 32.64,23.88 U4.3 | v9.02,25.4 8,26.42 8,53.72 6.6,55.12 6.6,60.96 5.21,62.36 3.68,62.36 3.68,64.64 2.92,65.41 SV1.1
  Bottom 0.178: v31.11,23.88 21.08,23.88 19.56,25.4 v9.02,25.4
PWMB  (via drill 0.41)
  Top 0.178: v32.26,52.45 32.26,29.97 31.11,29.97 30.61,29.46 30.61,28.19 32.64,28.19 U4.6
  Bottom 0.178: v32.26,52.45 27.43,57.28 7.75,57.28 5.21,59.82 4.7,59.82 3.68,60.83 3.68,62.87 2.92,62.87 SV1.3
PWMC  (via drill 0.41)
  Top 0.178: v25.91,30.48 25.91,29.97 26.42,29.46 U4.8 | v7.24,37.72 6.22,38.73 6.22,56.26 5.21,57.28 3.68,57.28 3.68,59.56 2.92,60.33 SV1.5
  Bottom 0.178: v25.91,30.48 18.67,37.72 v7.24,37.72
PWMD  (via drill 0.41)
  Top 0.178: v25.78,25.4 U4.11
  Bottom 0.178: v25.78,25.4 25.4,25.78 10.79,25.78 1.02,35.56 1.02,58.04 1.91,58.04 SV1.7
R_PWM_ENABLE  (via drill 0.41)
  Top 0.178: v13.08,30.48 13.08,11.68 20.83,11.68 20.95,11.81 26.42,11.81 R4.14 | v52.45,53.21 54.86,50.8 54.86,39.5 53.47,39.5 U2.41 | SV1.8 SV1.6
  Bottom 0.178: v13.08,30.48 6.6,36.96 2.16,36.96 1.4,37.72 1.4,57.28 3.68,57.28 4.45,58.04 SV1.8 | v52.45,53.21 44.96,60.71 5.71,60.71 SV1.6
R_PWM_FWD  (via drill 0.41)
  Top 0.178: v50.04,32.89 50.8,33.66 50.8,36.2 52.32,36.2 U2.37 | v29.08,26.92 28.32,26.92 U4.10
  Bottom 0.178: v50.04,32.89 44.07,26.92 v29.08,26.92
R_PWM_REV  (via drill 0.41)
  Top 0.178: v53.85,30.61 53.85,36.83 53.47,36.83 U2.38 | v25.02,24.64 26.42,23.24 26.42,23.11 U4.13
  Bottom 0.178: v53.85,30.61 47.88,24.64 v25.02,24.64
RMIS  (via drill 0.41)
  Top 0.178: v43.18,51.82 44.2,51.82 44.7,51.31 44.7,47.37 U2.57 | v15.24,59.18 14.61,59.82 R2.4 14.35,61.47 13.59,61.47 R2.3
  Bottom 0.178: v43.18,51.82 37.34,57.66 16.76,57.66 v15.24,59.18
RMISIN  (via drill 0.41)
  Top 0.178: v7.62,55.12 7.62,69.22 12.7,69.22 13.08,68.83 R2.14
  Bottom 0.178: v7.62,55.12 7.62,51.94 3.94,51.94 3.17,51.18 SV1.13
ROLL_AX
  Top 0.178: ADC2.6 65.28,29.46 62.99,29.46 62.99,21.84 63.12,21.72 63.12,17.78 61.85,16.51 61.85,5.33 59.18,2.67 53.72,2.67 53.72,3.17 ROLLX1.13
ROLL_AY  (via drill 0.41)
  Top 0.178: v64.52,30.23 65.28,30.23 ADC2.7 | v55.12,27.05 54.86,26.8 54.86,6.86 54.74,6.73 54.74,5.21 55.5,4.45 ROLLX1.15
  Bottom 0.178: v64.52,30.23 61.34,27.05 v55.12,27.05
ROLL_RATE  (via drill 0.41)
  Top 0.178: v64.64,8.64 64.64,27.43 65.28,27.43 ADC2.3
  Bottom 0.178: v64.64,8.64 59.56,3.56 59.56,2.67 47.12,2.67 46.35,3.43 ROLLX1.7
ROLL_TEMP  (via drill 0.41)
  Top 0.178: v63.88,25.53 63.88,28.83 65.28,28.83 ADC2.5 | v54.1,23.5 53.72,23.11 53.72,6.99 ROLLX1.14
  Bottom 0.178: v63.88,25.53 61.85,23.5 v54.1,23.5
ROLL_VREF  (via drill 0.41)
  Top 0.178: v67.31,27.94 67.31,28.07 66.55,28.07 ADC2.4
  Route15 0.178: ROLLX1.8 v67.31,27.94
RXD0  (via drill 0.41)
  Top 0.178: IC2.12 10.16,16.76 12.06,16.76 12.06,7.24 11.56,6.73 11.56,3.43 12.32,2.67 14.1,2.67 14.1,4.95 14.86,5.71 PROG.4 | v33.66,32.51 33.66,44.07 36.7,44.07 U2.2
  Route15 0.178: v33.66,32.51 35.18,30.99 35.18,25.4 15.88,6.1 PROG.4
RXD1  (via drill 0.41)
  Top 0.178: v9.78,27.81 9.78,18.92 IC2.9 | v44.07,32.51 46.86,32.51 46.86,31.75 U2.27
  Bottom 0.178: v9.78,27.81 10.41,28.45 40.01,28.45 v44.07,32.51
SG1  (via drill 0.41)
  Top 0.178: R2.7 18.67,61.47 19.43,61.47 R2.8 v19.68,59.94 | U2.60 42.42,47.37 42.42,52.32 43.56,53.47 C19.1 44.83,54.36 v45.59,55.12
  Bottom 0.178: v19.68,59.94 20.83,58.8 41.91,58.8 v45.59,55.12
SG2  (via drill 0.41)
  Top 0.178: R1.8 62.61,61.47 61.85,61.47 R1.7 61.34,60.71 v59.69,59.05 | v43.18,50.29 43.18,47.37 U2.59 | v45.72,53.47 46.74,53.47 C20.1
  Bottom 0.178: v43.18,50.29 44.2,50.29 45.85,51.94 45.85,52.45 | 45.85,52.45 45.85,53.47 v45.72,53.47 | v59.69,59.05 53.09,52.45 45.85,52.45
SGPWR
  Top 0.178: U14.1 75.31,44.96 72.64,44.96 C33.1 70.87,44.96 65.79,44.96 65.79,66.8 59.05,73.53 55.5,73.53 55.5,73.91 XSG.4 55.24,75.44 55.24,76.96 XSG.8 55.5,78.49 55.5,79.88 67.69,79.88 75.56,72.01 75.56,70.36 77.98,70.36 79.38,68.96 U12.9
TXD0  (via drill 0.41)
  Top 0.178: 11.68,17.4 12.7,17.4 12.7,7.87 13.84,6.73 13.84,5.33 13.08,4.57 13.08,4.45 PROG.1 | 11.68,17.4 10.16,17.4 IC2.11 | v34.54,42.29 34.54,43.18 36.7,43.18 U2.3 | v8.76,40.51 8.38,40.51 8.38,30.23 9.65,28.96 11.68,28.96 11.68,17.4
  Bottom 0.178: v34.54,42.29 32.77,40.51 v8.76,40.51
TXD1  (via drill 0.41)
  Top 0.178: v10.92,26.67 10.92,18.16 10.16,18.16 IC2.10 | v45.47,29.34 47.75,29.34 47.75,30.61 U2.28
  Bottom 0.178: v10.92,26.67 12.32,28.07 44.2,28.07 v45.47,29.34
VBATSENSE  (via drill 0.41)
  Top 0.178: v25.65,18.67 26.42,18.67 R4.9 | v9.02,24.38 3.94,29.46 3.94,46.86 4.7,47.62 SV1.16
  Bottom 0.178: v25.65,18.67 19.94,24.38 v9.02,24.38
VCC  (via drill 0.41)
  Top 0.254: CD15.1 30.1,76.58 23.88,76.58 23.88,76.45 23.37,75.95 20.7,75.95 20.7,75.44 XKNOB.2 | CD12.1 76.71,71.5 67.82,80.39 30.86,80.39 30.86,77.09 CD15.1 | CD15.1 30.86,76.58 31.37,76.07 31.37,71.5 35.94,66.93 36.45,66.93 CD16.1 37.21,66.93 39.75,66.93 U10.16 40.13,66.93 v40.13,66.04 | 19.3,43.81 U13.2 | CD9.1 23.75,41.27 | 25.65,41.27 25.53,41.4 | 22.86,21.21 23.37,21.21 26.42,21.21 26.42,21.34 U4.14 | 22.86,21.21 21.46,21.21 20.95,21.72 CD10.1 | 22.86,21.21 22.86,16.38 21.84,15.37 C6.2 21.84,14.22 v22.61,14.22 | 23.37,38.21 CD14.1 | UYAW.E7 75.82,30.35 75.82,32.51 77.09,33.78 CD4.1 77.85,33.4 78.49,32.77 v78.49,23.5 | PITCHX1.12 84.96,43.05 83.95,43.05 83.95,21.46 SG1.+ | IC2.16 9.4,14.1 6.22,14.1 6.22,13.84 5.59,13.21 1.4,13.21 1.4,20.57 2.16,21.34 SERIAL.8 | v41.53,20.07 41.53,28.19 CD7.1 41.78,28.96 42.16,29.34 42.16,30.61 U2.21 42.29,31.75 42.29,33.4 43.56,33.4 48.64,38.48 48.64,46.23 U2.52 48.77,47.37 48.77,48.9 CD2.1 49.15,49.66 50.04,50.55 50.04,57.4 v51.56,57.4
  Top 0.61: 19.3,43.81 19.3,42.42 CD17.1 19.3,41.4 21.08,41.4 CD5.1 21.97,41.27 23.75,41.27 | CD11.1 21.97,38.23 23.75,38.23 CD14.1 24.51,38.23 25.65,38.23 25.65,41.27 | 25.53,41.4 24.51,41.4 CD9.1 | 23.37,21.21 23.37,38.21
  Bottom 0.254: PROG.2 12.06,6.73 11.37,7.43 5.59,13.21 2.03,13.21 1.4,13.84 1.4,21.59 1.91,21.59 SERIAL.8
  Bottom 0.61: SG1.+ 82.68,20.95 81.03,20.95 v78.49,23.5 78.11,23.37 73.79,19.05 41.53,19.05 | 22.61,7.87 11.43,7.87 11.37,7.43 | 22.61,7.87 41.53,7.87 | 41.53,7.87 49.02,7.87 50.16,6.73 ROLLX1.12 | 41.53,7.87 41.53,19.05 | 41.53,19.05 v41.53,20.07 | 22.61,7.87 v22.61,14.22 | v40.13,66.04 43.31,62.87 46.1,62.87 v51.56,57.4
  other vias: 72.39,19.05
  pour Top (isolate 0.305, rank 3): 1.27,81.28 90.17,81.28 90.17,1.27 1.27,1.27
YAW_AX  (via drill 0.41)
  Top 0.178: 61.85,52.32 62.61,52.32 C18.1 | 61.85,52.32 60.96,52.32 U11.12 | v61.85,50.29 61.85,39.75 65.28,39.75 ADC1.4 | v61.85,51.82 61.85,52.32
  Route2 0.178: v61.85,50.29 v61.85,51.82
YAW_AY
  Top 0.178: U11.10 60.96,51.05 62.61,51.05 C16.1 62.87,50.42 62.87,40.26 65.28,40.26 ADC1.5
YAW_RATE  (via drill 0.41)
  Top 0.178: 72.9,22.61 72.9,21.59 73.28,21.21 R6.1 73.28,20.95 71.5,20.95 C36.2 | 72.9,22.61 72.9,25.02 73.15,25.27 UYAW.B1 | v66.55,33.02 66.55,37.59 ADC1.1 | 72.9,22.61 v72.52,22.61
  Route15 0.178: v66.55,33.02 66.55,32.51 72.52,26.54 v72.52,22.61
YAW_TEMP  (via drill 0.41)
  Top 0.178: v77.6,32.13 77.98,31.75 77.98,27.18 77.47,27.18 UYAW.G3 | v64.9,36.96 64.77,37.08 64.77,38.61 65.28,39.12 ADC1.3
  Bottom 0.178: v77.6,32.13 72.77,36.96 v64.9,36.96
YAW_VREF  (via drill 0.41)
  Top 0.178: v75.56,23.5 75.56,25.27 UYAW.E1 | v67.44,33.91 66.93,34.42 66.93,38.1 66.55,38.48 ADC1.2
  Route15 0.178: v75.56,23.5 75.56,25.78 v67.44,33.91

### Text on the board
tPlace: scooter9